# EAGLE design pi3_hat (EAGLE 9.6.0)
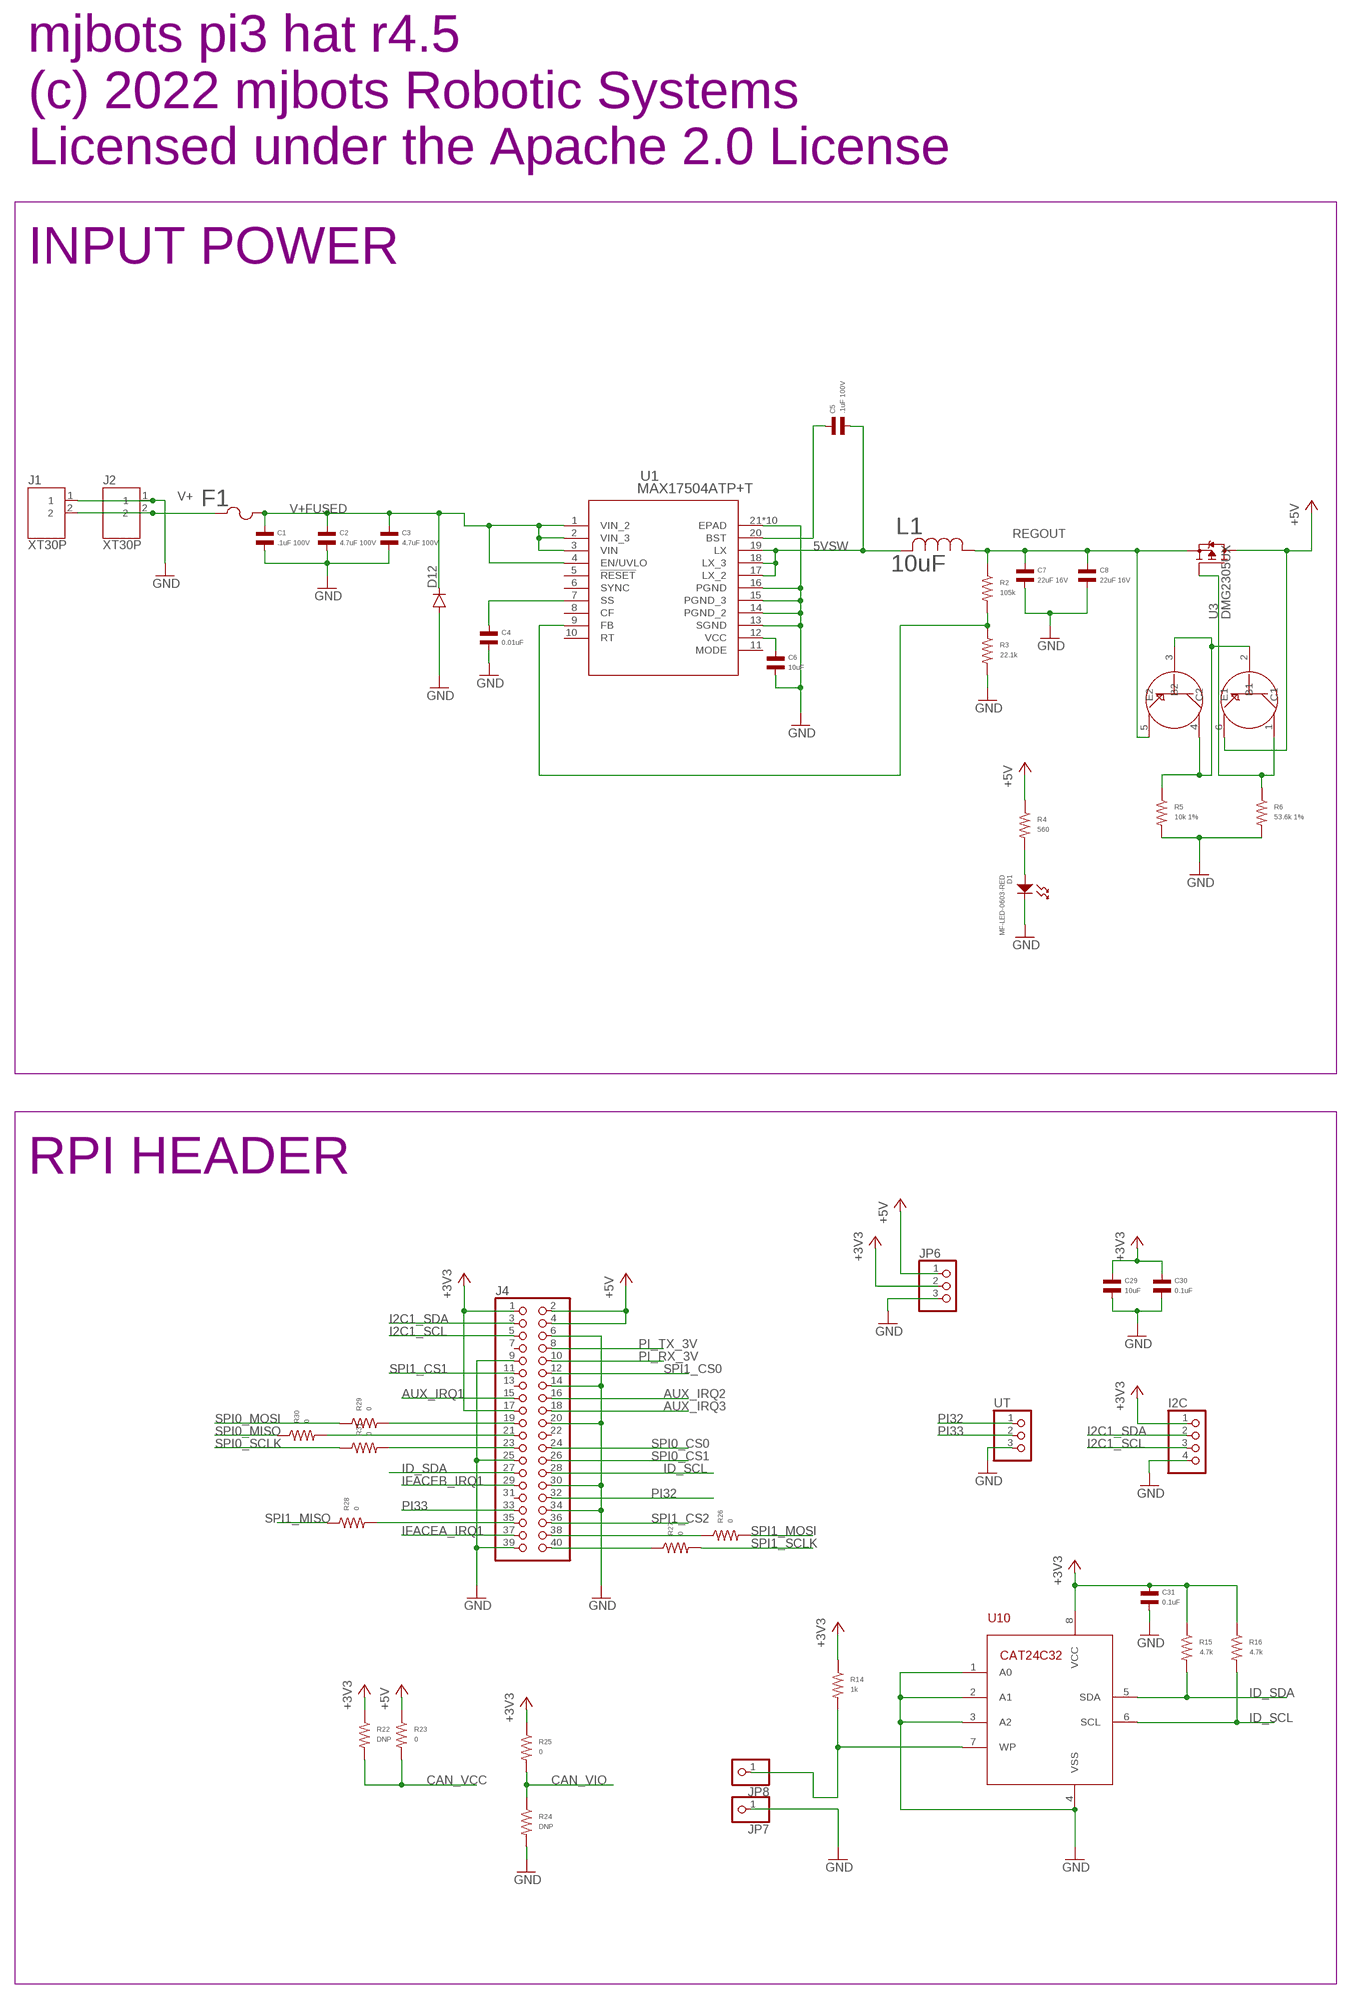
[diagram p0: schematic, sheet 1, part 1 of 3]
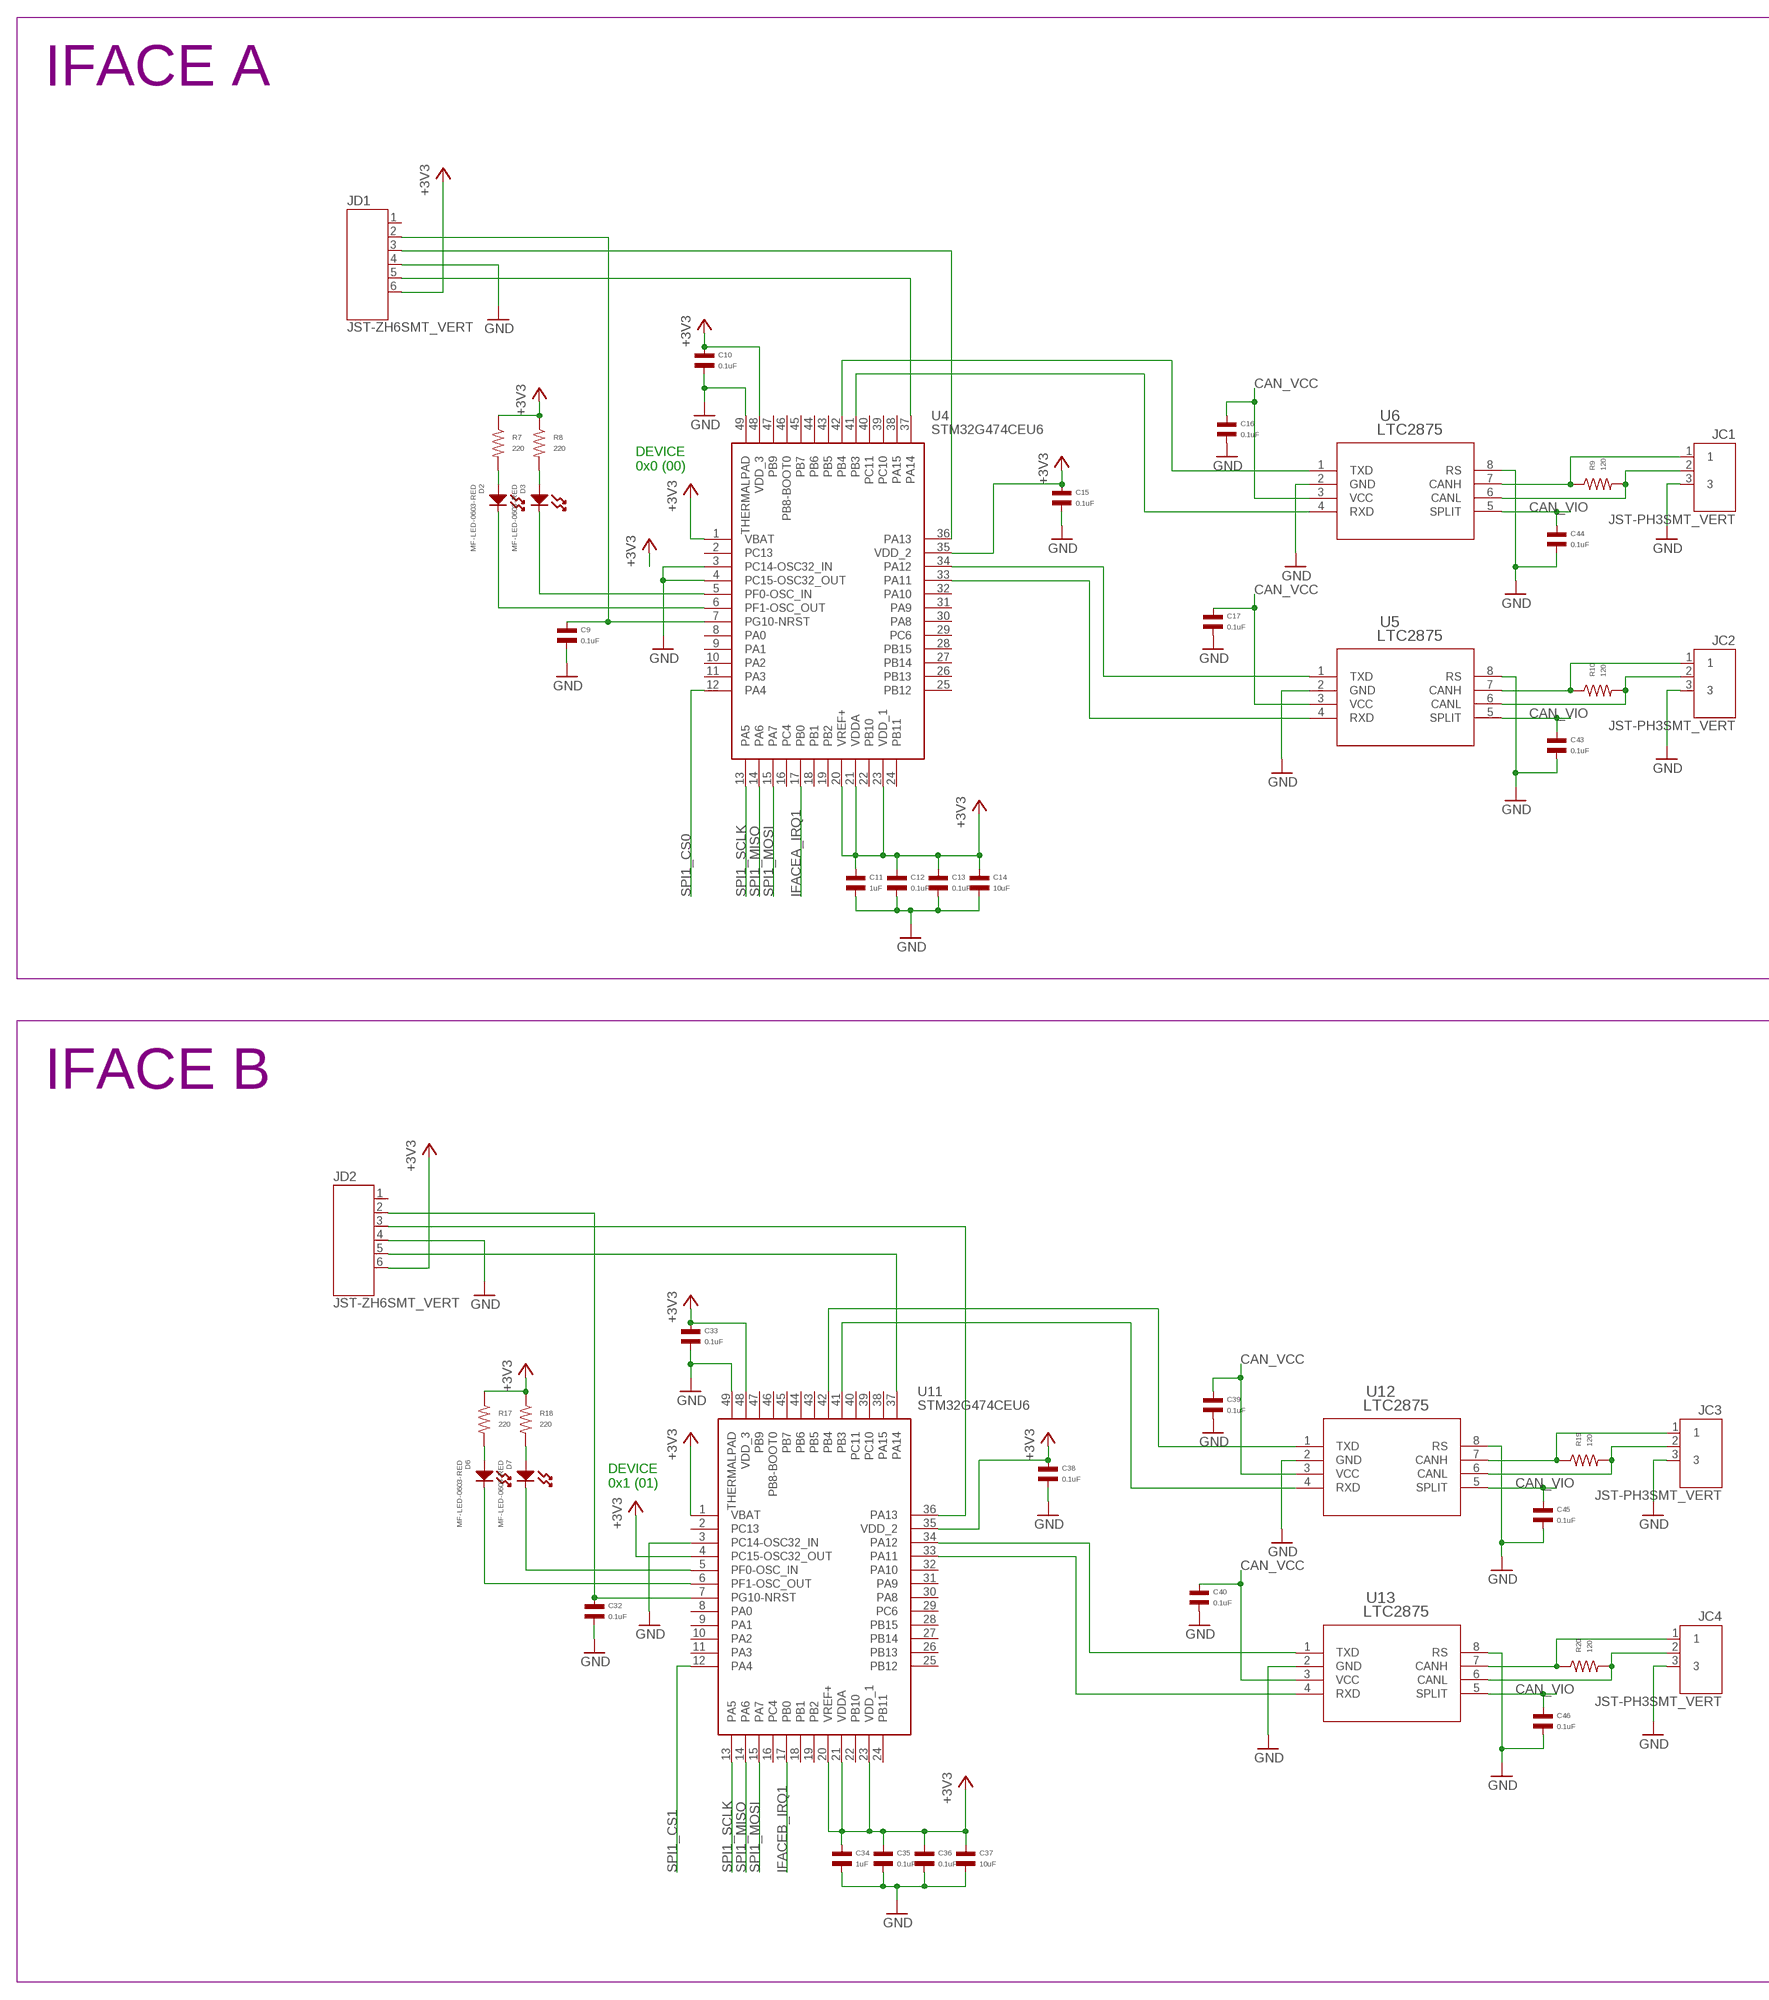
[diagram p1: schematic, sheet 1, part 2 of 3]
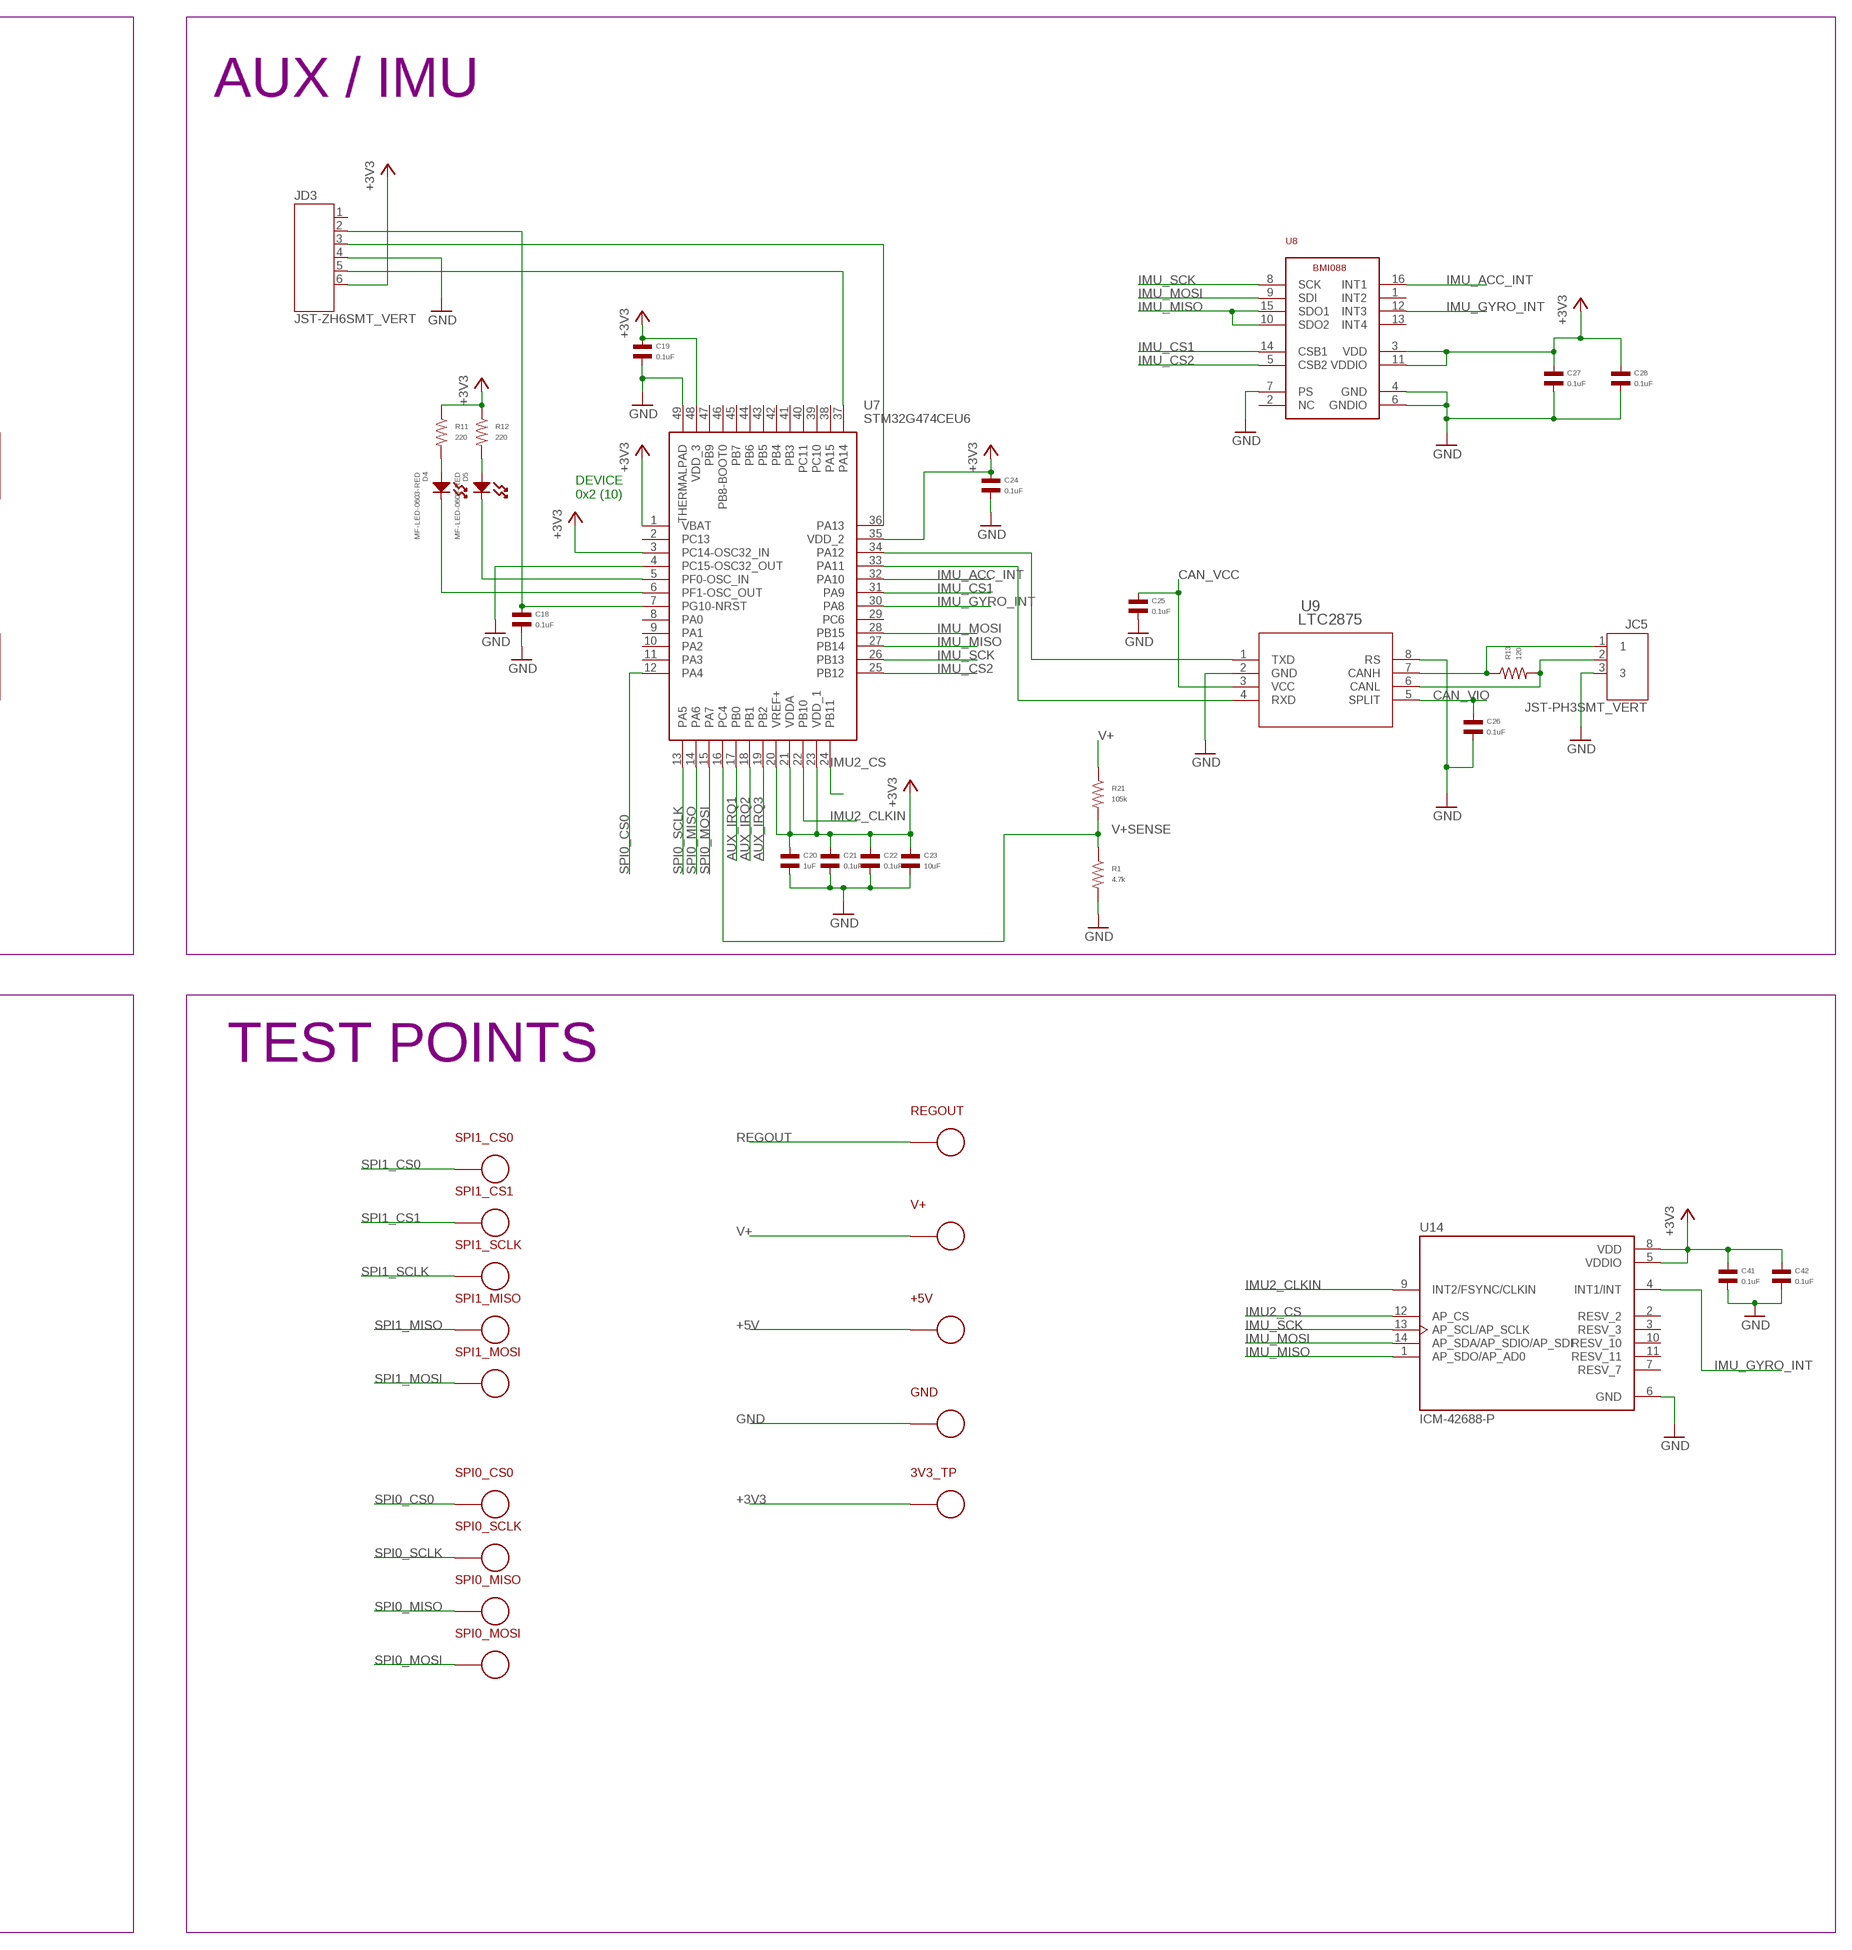
[diagram p2: schematic, sheet 1, part 3 of 3]

## Parts
3V3_TP  PAD24AWG_PAD  [24AWG_PAD]
+5V  PAD24AWG_PAD  [24AWG_PAD]
C1  .1uF 100V  CAPACITOR_NP_0805  [C0805]
C2  4.7uF 100V  CAPACITOR_NP_1206  [C1206]
C3  4.7uF 100V  CAPACITOR_NP_1206  [C1206]
C4  0.01uF  CAPACITOR_NP_0603  [C0603]
C5  .1uF 100V  CAPACITOR_NP_0805  [C0805]
C6  10uF  CAPACITOR_NP_1206  [C1206]
C7  22uF 16V  CAPACITOR_NP_1210  [C1210]
C8  22uF 16V  CAPACITOR_NP_1210  [C1210]
C9  0.1uF  CAPACITOR_NP_0402  [C0402]
C10  0.1uF  CAPACITOR_NP_0402  [C0402]
C11  1uF  CAPACITOR_NP_0402  [C0402]
C12  0.1uF  CAPACITOR_NP_0402  [C0402]
C13  0.1uF  CAPACITOR_NP_0402  [C0402]
C14  10uF  CAPACITOR_NP_1206  [C1206]
C15  0.1uF  CAPACITOR_NP_0402  [C0402]
C16  0.1uF  CAPACITOR_NP_0402  [C0402]
C17  0.1uF  CAPACITOR_NP_0402  [C0402]
C18  0.1uF  CAPACITOR_NP_0402  [C0402]
C19  0.1uF  CAPACITOR_NP_0402  [C0402]
C20  1uF  CAPACITOR_NP_0402  [C0402]
C21  0.1uF  CAPACITOR_NP_0402  [C0402]
C22  0.1uF  CAPACITOR_NP_0402  [C0402]
C23  10uF  CAPACITOR_NP_1206  [C1206]
C24  0.1uF  CAPACITOR_NP_0402  [C0402]
C25  0.1uF  CAPACITOR_NP_0402  [C0402]
C26  0.1uF  CAPACITOR_NP_0402  [C0402]
C27  0.1uF  CAPACITOR_NP_0402  [C0402]
C28  0.1uF  CAPACITOR_NP_0402  [C0402]
C29  10uF  CAPACITOR_NP_1206  [C1206]
C30  0.1uF  CAPACITOR_NP_0402  [C0402]
C31  0.1uF  CAPACITOR_NP_0402  [C0402]
C32  0.1uF  CAPACITOR_NP_0402  [C0402]
C33  0.1uF  CAPACITOR_NP_0402  [C0402]
C34  1uF  CAPACITOR_NP_0402  [C0402]
C35  0.1uF  CAPACITOR_NP_0402  [C0402]
C36  0.1uF  CAPACITOR_NP_0402  [C0402]
C37  10uF  CAPACITOR_NP_1206  [C1206]
C38  0.1uF  CAPACITOR_NP_0402  [C0402]
C39  0.1uF  CAPACITOR_NP_0402  [C0402]
C40  0.1uF  CAPACITOR_NP_0402  [C0402]
C41  0.1uF  CAPACITOR_NP_0402  [C0402]
C42  0.1uF  CAPACITOR_NP_0402  [C0402]
C43  0.1uF  CAPACITOR_NP_0402  [C0402]
C44  0.1uF  CAPACITOR_NP_0402  [C0402]
C45  0.1uF  CAPACITOR_NP_0402  [C0402]
C46  0.1uF  CAPACITOR_NP_0402  [C0402]
D1  MF-LED-0603-RED  LED_SINGLE-0603-RED  [LED0603]
D2  MF-LED-0603-RED  LED_SINGLE-0603-RED  [LED0603]
D3  MF-LED-0603-RED  LED_SINGLE-0603-RED  [LED0603]
D4  MF-LED-0603-RED  LED_SINGLE-0603-RED  [LED0603]
D5  MF-LED-0603-RED  LED_SINGLE-0603-RED  [LED0603]
D6  MF-LED-0603-RED  LED_SINGLE-0603-RED  [LED0603]
D7  MF-LED-0603-RED  LED_SINGLE-0603-RED  [LED0603]
D12  DIODE-DO214AA  [DO214AA]
F1  MFU0603FF04000P100  [FUS_VISHAY_MFU0603]
GND  PAD24AWG_PAD  [24AWG_PAD]
I2C  PINHD-1X4  [1X04]
J1  XT30P  [XT30P]
J2  XT30P  [XT30P]
J4  PI3_HEADER2X20-FLIP  [2X20FLIP]
JC1  JST-PH3SMT_VERT  [JST_B3B_PH-SM4-TB(LF)(SN)]
JC2  JST-PH3SMT_VERT  [JST_B3B_PH-SM4-TB(LF)(SN)]
JC3  JST-PH3SMT_VERT  [JST_B3B_PH-SM4-TB(LF)(SN)]
JC4  JST-PH3SMT_VERT  [JST_B3B_PH-SM4-TB(LF)(SN)]
JC5  JST-PH3SMT_VERT  [JST_B3B_PH-SM4-TB(LF)(SN)]
JD1  JST-ZH6SMT_VERT  [JST_B6B-ZR-SM4-TF(LF)(SN)]
JD2  JST-ZH6SMT_VERT  [JST_B6B-ZR-SM4-TF(LF)(SN)]
JD3  JST-ZH6SMT_VERT  [JST_B6B-ZR-SM4-TF(LF)(SN)]
JP6  PINHD-1X3  [1X03]
JP7  PINHD-1X1  [1X01]
JP8  PINHD-1X1  [1X01]
L1  10uF  NS10165T100MNA  [IND_YUDEN_NS10165_YDN]
R1  4.7k  RESISTOR_0402  [R0402]
R2  105k  RESISTOR_0402  [R0402]
R3  22.1k  RESISTOR_0402  [R0402]
R4  560  RESISTOR_0402  [R0402]
R5  10k 1%  RESISTOR_0603  [R0603]
R6  53.6k 1%  RESISTOR_0603  [R0603]
R7  220  RESISTOR_0402  [R0402]
R8  220  RESISTOR_0402  [R0402]
R9  120  RESISTOR_0402  [R0402]
R10  120  RESISTOR_0402  [R0402]
R11  220  RESISTOR_0402  [R0402]
R12  220  RESISTOR_0402  [R0402]
R13  120  RESISTOR_0402  [R0402]
R14  1k  RESISTOR_0402  [R0402]
R15  4.7k  RESISTOR_0402  [R0402]
R16  4.7k  RESISTOR_0402  [R0402]
R17  220  RESISTOR_0402  [R0402]
R18  220  RESISTOR_0402  [R0402]
R19  120  RESISTOR_0402  [R0402]
R20  120  RESISTOR_0402  [R0402]
R21  105k  RESISTOR_0402  [R0402]
R22  DNP  RESISTOR_0402  [R0402]
R23  0  RESISTOR_0402  [R0402]
R24  DNP  RESISTOR_0402  [R0402]
R25  0  RESISTOR_0402  [R0402]
R26  0  RESISTOR_0402  [R0402]
R27  0  RESISTOR_0402  [R0402]
R28  0  RESISTOR_0402  [R0402]
R29  0  RESISTOR_0402  [R0402]
R30  0  RESISTOR_0402  [R0402]
R31  0  RESISTOR_0402  [R0402]
REGOUT  PAD24AWG_PAD  [24AWG_PAD]
SPI0_CS0  PAD24AWG_PAD  [24AWG_PAD]
SPI0_MISO  PAD24AWG_PAD  [24AWG_PAD]
SPI0_MOSI  PAD24AWG_PAD  [24AWG_PAD]
SPI0_SCLK  PAD24AWG_PAD  [24AWG_PAD]
SPI1_CS0  PAD24AWG_PAD  [24AWG_PAD]
SPI1_CS1  PAD24AWG_PAD  [24AWG_PAD]
SPI1_MISO  PAD24AWG_PAD  [24AWG_PAD]
SPI1_MOSI  PAD24AWG_PAD  [24AWG_PAD]
SPI1_SCLK  PAD24AWG_PAD  [24AWG_PAD]
U1  MAX17504ATP+T  [21-0140L_T2055-4_MXM]
U2  DMMT5401  [SOT26]
U3  DMG2305UX  [SOT23]
U4  STM32G474CEU6  [QFN50P700X700X60-49N]
U5  LTC2875  [SOIC8]
U6  LTC2875  [SOIC8]
U7  STM32G474CEU6  [QFN50P700X700X60-49N]
U8  BMI088LGA16  [LGA16]
U9  LTC2875  [SOIC8]
U10  CAT24C32UDFN8  [UDFN8_2X3_ONS]
U11  STM32G474CEU6  [QFN50P700X700X60-49N]
U12  LTC2875  [SOIC8]
U13  LTC2875  [SOIC8]
U14  ICM-42688-P  [PQFN50P300X250X97-14N]
UT  PINHD-1X3  [1X03]
V+  PAD24AWG_PAD  [24AWG_PAD]

## Nets
5VSW: C5.P$2 L1.2 U1.17(LX_2) U1.18(LX_3) U1.19(LX)
+3V3: 3V3_TP.P$1 C10.P$1 C11.P$1 C12.P$1 C13.P$1 C14.P$1 C15.P$1 C19.P$1 C20.P$1 C21.P$1 C22.P$1 C23.P$1 C24.P$1 C27.P$1 C28.P$1 C29.P$1 C30.P$1 C31.P$1 C33.P$1 C34.P$1 C35.P$1 C36.P$1 C37.P$1 C38.P$1 C41.P$1 C42.P$1 I2C.1 J4.1 J4.17 JD1.6 JD2.6 JD3.6 JP6.2 R7.P$1 R8.P$1 R11.P$1 R12.P$1 R14.P$1 R15.P$1 R16.P$1 R17.P$1 R18.P$1 R22.P$1 R25.P$1 U4.1(VBAT) U4.20(VREF+) U4.21(VDDA) U4.23(VDD_1) U4.35(VDD_2) U4.48(VDD_3) U7.1(VBAT) U7.3(PC14-OSC32_IN) U7.20(VREF+) U7.21(VDDA) U7.23(VDD_1) U7.35(VDD_2) U7.48(VDD_3) U8.3(VDD) U8.11(VDDIO) U10.8(VCC) U11.1(VBAT) U11.4(PC15-OSC32_OUT) U11.20(VREF+) U11.21(VDDA) U11.23(VDD_1) U11.35(VDD_2) U11.48(VDD_3) U14.5(VDDIO) U14.8(VDD)
+5V: +5V.P$1 J4.2 J4.4 JP6.1 R4.P$1 R23.P$1 U2.6(E1) U3.3(D)
AUX_IRQ1: J4.15 U7.17(PB0)
AUX_IRQ2: J4.16 U7.18(PB1)
AUX_IRQ3: J4.18 U7.19(PB2)
CAN_VCC: C16.P$1 C17.P$1 C25.P$1 C39.P$1 C40.P$1 R22.P$2 R23.P$2 U5.3(VCC) U6.3(VCC) U9.3(VCC) U12.3(VCC) U13.3(VCC)
CAN_VIO: C26.P$1 C43.P$1 C44.P$1 C45.P$1 C46.P$1 R24.P$1 R25.P$2 U5.5(SPLIT) U6.5(SPLIT) U9.5(SPLIT) U12.5(SPLIT) U13.5(SPLIT)
FB: R2.P$2 R3.P$1 U1.9(FB)
GND: C1.P$2 C2.P$2 C3.P$2 C4.P$2 C6.P$2 C7.P$2 C8.P$2 C9.P$2 C10.P$2 C11.P$2 C12.P$2 C13.P$2 C14.P$2 C15.P$2 C16.P$2 C17.P$2 C18.P$2 C19.P$2 C20.P$2 C21.P$2 C22.P$2 C23.P$2 C24.P$2 C25.P$2 C26.P$2 C27.P$2 C28.P$2 C29.P$2 C30.P$2 C31.P$2 C32.P$2 C33.P$2 C34.P$2 C35.P$2 C36.P$2 C37.P$2 C38.P$2 C39.P$2 C40.P$2 C41.P$2 C42.P$2 C43.P$2 C44.P$2 C45.P$2 C46.P$2 D1.CATHODE D12.A GND.P$1 I2C.4 J1.1 J2.1 J4.6 J4.9 J4.14 J4.20 J4.25 J4.30 J4.34 J4.39 JC1.3 JC2.3 JC3.3 JC4.3 JC5.3 JD1.4 JD2.4 JD3.4 JP6.3 JP7.1 R1.P$2 R3.P$2 R5.P$2 R6.P$2 R24.P$2 U1.13(SGND) U1.14(PGND_2) U1.15(PGND_3) U1.16(PGND) U1.21(EPAD) U1.22(EPAD) U1.23(EPAD) U1.24(EPAD) U1.25(EPAD) U1.26(EPAD) U1.27(EPAD) U1.28(EPAD) U1.29(EPAD) U1.30(EPAD) U4.3(PC14-OSC32_IN) U4.4(PC15-OSC32_OUT) U4.49(THERMALPAD) U5.2(GND) U5.8(RS) U6.2(GND) U6.8(RS) U7.4(PC15-OSC32_OUT) U7.49(THERMALPAD) U8.4(GND) U8.6(GNDIO) U8.7(PS) U9.2(GND) U9.8(RS) U10.1(A0) U10.2(A1) U10.3(A2) U10.4(VSS) U11.3(PC14-OSC32_IN) U11.49(THERMALPAD) U12.2(GND) U12.8(RS) U13.2(GND) U13.8(RS) U14.6(GND) UT.3
I2C1_SCL: I2C.3 J4.5
I2C1_SDA: I2C.2 J4.3
ID_SCL: J4.28 R16.P$2 U10.6(SCL)
ID_SDA: J4.27 R15.P$2 U10.5(SDA)
IFACEA_IRQ1: J4.37 U4.17(PB0)
IFACEB_IRQ1: J4.29 U11.17(PB0)
IMU2_CLKIN: U7.22(PB10) U14.9(INT2/FSYNC/CLKIN)
IMU2_CS: U7.24(PB11) U14.12(AP_CS)
IMU_ACC_INT: U7.32(PA10) U8.16(INT1)
IMU_CS1: U7.31(PA9) U8.14(CSB1)
IMU_CS2: U7.25(PB12) U8.5(CSB2)
IMU_GYRO_INT: U7.30(PA8) U8.12(INT3) U14.4(INT1/INT)
IMU_MISO: U7.27(PB14) U8.10(SDO2) U8.15(SDO1) U14.1(AP_SDO/AP_AD0)
IMU_MOSI: U7.28(PB15) U8.9(SDI) U14.14(AP_SDA/AP_SDIO/AP_SDI)
IMU_SCK: U7.26(PB13) U8.8(SCK) U14.13(AP_SCL/AP_SCLK)
N$1: R5.P$1 U2.2(B1) U2.3(B2) U2.4(C2)
N$2: JC1.1 R9.P$1 U6.7(CANH)
N$3: J4.38 R26.P$1
N$4: JC1.2 R9.P$2 U6.6(CANL)
N$5: R6.P$1 U2.1(C1) U3.1(G)
N$6: J4.40 R27.P$1
N$7: JC2.1 R10.P$1 U5.7(CANH)
N$8: JC2.2 R10.P$2 U5.6(CANL)
N$9: D1.ANODE R4.P$2
N$10: J4.35 R28.P$2
N$11: U4.33(PA11) U5.4(RXD)
N$12: J4.19 R29.P$2
N$13: C9.P$1 JD1.2 U4.7(PG10-NRST)
N$14: C5.P$1 U1.20(BST)
N$15: JD1.3 U4.36(PA13)
N$16: JD1.5 U4.37(PA14)
N$17: U4.41(PB3) U6.4(RXD)
N$18: U4.42(PB4) U6.1(TXD)
N$19: C4.P$1 U1.7(SS)
N$20: J4.21 R30.P$2
N$21: C6.P$1 U1.12(VCC)
N$22: J4.23 R31.P$2
N$23: JC3.1 R19.P$1 U12.7(CANH)
N$25: JC3.2 R19.P$2 U12.6(CANL)
N$26: JC4.1 R20.P$1 U13.7(CANH)
N$27: JC4.2 R20.P$2 U13.6(CANL)
N$28: D3.ANODE R8.P$2
N$29: D3.CATHODE U4.5(PF0-OSC_IN)
N$30: D2.ANODE R7.P$2
N$31: D2.CATHODE U4.6(PF1-OSC_OUT)
N$32: C32.P$1 JD2.2 U11.7(PG10-NRST)
N$33: JD2.3 U11.36(PA13)
N$34: JD2.5 U11.37(PA14)
N$35: D7.ANODE R18.P$2
N$36: D7.CATHODE U11.5(PF0-OSC_IN)
N$37: D6.ANODE R17.P$2
N$38: D6.CATHODE U11.6(PF1-OSC_OUT)
N$39: U11.33(PA11) U13.4(RXD)
N$40: U11.34(PA12) U13.1(TXD)
N$41: U11.41(PB3) U12.4(RXD)
N$42: U11.42(PB4) U12.1(TXD)
N$44: JP8.1 R14.P$2 U10.7(WP)
N$45: JC5.1 R13.P$1 U9.7(CANH)
N$46: JC5.2 R13.P$2 U9.6(CANL)
N$47: C18.P$1 JD3.2 U7.7(PG10-NRST)
N$48: JD3.3 U7.36(PA13)
N$49: JD3.5 U7.37(PA14)
N$50: D5.ANODE R12.P$2
N$51: D5.CATHODE U7.5(PF0-OSC_IN)
N$52: D4.ANODE R11.P$2
N$53: D4.CATHODE U7.6(PF1-OSC_OUT)
N$54: U7.33(PA11) U9.4(RXD)
N$55: U7.34(PA12) U9.1(TXD)
N$100: U4.34(PA12) U5.1(TXD)
PI32: J4.32 UT.1
PI33: J4.33 UT.2
PI_RX_3V: J4.10
PI_TX_3V: J4.8
REGOUT: C7.P$1 C8.P$1 L1.1 R2.P$1 REGOUT.P$1 U2.5(E2) U3.2(S)
SPI0_CS0: J4.24 SPI0_CS0.P$1 U7.12(PA4)
SPI0_CS1: J4.26
SPI0_MISO: R30.P$1 SPI0_MISO.P$1 U7.14(PA6)
SPI0_MOSI: R29.P$1 SPI0_MOSI.P$1 U7.15(PA7)
SPI0_SCLK: R31.P$1 SPI0_SCLK.P$1 U7.13(PA5)
SPI1_CS0: J4.12 SPI1_CS0.P$1 U4.12(PA4)
SPI1_CS1: J4.11 SPI1_CS1.P$1 U11.12(PA4)
SPI1_CS2: J4.36
SPI1_MISO: R28.P$1 SPI1_MISO.P$1 U4.14(PA6) U11.14(PA6)
SPI1_MOSI: R26.P$2 SPI1_MOSI.P$1 U4.15(PA7) U11.15(PA7)
SPI1_SCLK: R27.P$2 SPI1_SCLK.P$1 U4.13(PA5) U11.13(PA5)
V+: F1.1 J1.2 J2.2 R21.P$1 V+.P$1
V+FUSED: C1.P$1 C2.P$1 C3.P$1 D12.C F1.2 U1.1(VIN_2) U1.2(VIN_3) U1.3(VIN) U1.4(EN/UVLO)
V+SENSE: R1.P$1 R21.P$2 U7.16(PC4)
Unconnected: J4.7 J4.13 J4.22 J4.31 JD1.1 JD2.1 JD3.1 U1.5(!RESET) U1.6(SYNC) U1.8(CF) U1.10(RT) U1.11(MODE) U4.2(PC13) U4.8(PA0) U4.9(PA1) U4.10(PA2) U4.11(PA3) U4.16(PC4) U4.18(PB1) U4.19(PB2) U4.22(PB10) U4.24(PB11) U4.25(PB12) U4.26(PB13) U4.27(PB14) U4.28(PB15) U4.29(PC6) U4.30(PA8) U4.31(PA9) U4.32(PA10) U4.38(PA15) U4.39(PC10) U4.40(PC11) U4.43(PB5) U4.44(PB6) U4.45(PB7) U4.46(PB8-BOOT0) U4.47(PB9) U7.2(PC13) U7.8(PA0) U7.9(PA1) U7.10(PA2) U7.11(PA3) U7.29(PC6) U7.38(PA15) U7.39(PC10) U7.40(PC11) U7.41(PB3) U7.42(PB4) U7.43(PB5) U7.44(PB6) U7.45(PB7) U7.46(PB8-BOOT0) U7.47(PB9) U8.1(INT2) U8.2(NC) U8.13(INT4) U11.2(PC13) U11.8(PA0) U11.9(PA1) U11.10(PA2) U11.11(PA3) U11.16(PC4) U11.18(PB1) U11.19(PB2) U11.22(PB10) U11.24(PB11) U11.25(PB12) U11.26(PB13) U11.27(PB14) U11.28(PB15) U11.29(PC6) U11.30(PA8) U11.31(PA9) U11.32(PA10) U11.38(PA15) U11.39(PC10) U11.40(PC11) U11.43(PB5) U11.44(PB6) U11.45(PB7) U11.46(PB8-BOOT0) U11.47(PB9) U14.2(RESV_2) U14.3(RESV_3) U14.7(RESV_7) U14.10(RESV_10) U14.11(RESV_11)

## Notes on the sheet
- mjbots pi3 hat r4.5
  (c) 2022 mjbots Robotic Systems
  Licensed under the Apache 2.0 License
- INPUT POWER | IFACE A | AUX / IMU
- DEVICE
  0x0 (00)
- DEVICE
  0x2 (10)
- RPI HEADER | IFACE B | TEST POINTS
- DEVICE
  0x1 (01)

## Library data of the parts
3V3_TP +5V GND REGOUT SPI0_CS0 SPI0_MISO SPI0_MOSI SPI0_SCLK SPI1_CS0 SPI1_CS1 SPI1_MISO SPI1_MOSI SPI1_SCLK V+ = pi3_hat:PAD; POPULATE: 0
C1 C5 = mfpassives:CAPACITOR_NP: Library: MF_Passives Description: Device for Non-Polarized Capacitors. Manufacture part number (MPN) can be added via Attributes. Check https://factory.macrofab.com/parts for the house parts list.; HOUSEPART: 0; MF: KYOCERA; MPN: 08051C104KAZ2A; POPULATE: 1
C2 C3 = mfpassives:CAPACITOR_NP: Library: MF_Passives Description: Device for Non-Polarized Capacitors. Manufacture part number (MPN) can be added via Attributes. Check https://factory.macrofab.com/parts for the house parts list.; MF: MURATA; MPN: GRJ31CC72A475KE01K; POPULATE: 1
C4 = mfpassives:CAPACITOR_NP: Library: MF_Passives Description: Device for Non-Polarized Capacitors. Manufacture part number (MPN) can be added via Attributes. Check https://factory.macrofab.com/parts for the house parts list.; MPN: MF-CAP-0603-0.01uF; POPULATE: 1
C6 C14 C23 C29 C37 = mfpassives:CAPACITOR_NP: Library: MF_Passives Description: Device for Non-Polarized Capacitors. Manufacture part number (MPN) can be added via Attributes. Check https://factory.macrofab.com/parts for the house parts list.; HOUSEPART: YES; MPN: MF-CAP-1206-10uF; POPULATE: 1
C7 C8 = mfpassives:CAPACITOR_NP: Library: MF_Passives Description: Device for Non-Polarized Capacitors. Manufacture part number (MPN) can be added via Attributes. Check https://factory.macrofab.com/parts for the house parts list.; MF: SAMSUNG; MPN: CL32A226KOJNNNE; POPULATE: 1
C9 C10 C12 C13 C15-C19 C21 C22 C24-C28 C30-C33 C35 C36 C38-C46 = mfpassives:CAPACITOR_NP: Library: MF_Passives Description: Device for Non-Polarized Capacitors. Manufacture part number (MPN) can be added via Attributes. Check https://factory.macrofab.com/parts for the house parts list.; HOUSEPART: YES; MPN: MF-CAP-0402-0.1uF; POPULATE: 1
C11 C20 C34 = mfpassives:CAPACITOR_NP: Library: MF_Passives Description: Device for Non-Polarized Capacitors. Manufacture part number (MPN) can be added via Attributes. Check https://factory.macrofab.com/parts for the house parts list.; HOUSEPART: YES; MPN: MF-CAP-0402-1uF; POPULATE: 1
D1 D2 D4 D6 = mfleds:LED_SINGLE: Library: MF_LEDs Description: Device for Single LED Packages. Manufacture part number (MFG#) can be added via Attributes.; HOUSEPART: YES; MPN: MF-LED-0603-RED; POPULATE: 1; URL: https://factory.macrofab.com/part/MF-LED-0603-RED
D3 D5 D7 = mfleds:LED_SINGLE: Library: MF_LEDs Description: Device for Single LED Packages. Manufacture part number (MFG#) can be added via Attributes.; HOUSEPART: YES; MPN: MF-LED-0603-GREEN; POPULATE: 1; URL: https://factory.macrofab.com/part/MF-LED-0603-RED
D12 = diode:DIODE-: DIODE; MF: LITTLEFUSE; MPN: SMBJ51A-13-F; POPULATE: 1
F1 = pi3_hat:MFU0603FF04000P100; DPN: 507-2154-1-ND; MF: BEL FUSE; MPN: 0686F4000-01; POPULATE: 1; VENDOR: BEL FUSE
I2C = pinhead:PINHD-1X4: PIN HEADER; MF: MacroFab; MPN: MF-CON-2.54mm-01x04; POPULATE: 1
J1 J2 = pi3_hat:XT30; MF: AMASS; MPN: XT30UPB-M; POPULATE: 1
J4 = pi3_hat:PI3_HEADER: PIN HEADER; MF: SULLINS; MPN: PPPC202LFBN-RC; POPULATE: 1
JC1-JC5 = pi3_hat:JST-PH3; MF: JST; MPN: B3B-PH-SM4-TB(LF)(SN); POPULATE: 1
JD1-JD3 = pi3_hat:JST-ZH6; MF: JST; MPN: B6B-ZR-SM4-TF(LF)(SN); POPULATE: 1
JP6 UT = pinhead:PINHD-1X3: PIN HEADER; MF: MacroFab; MPN: MF-CON-2.54mm-01x03; POPULATE: 1
JP7 JP8 = adafruit:PINHD-1X1: Pin header 1x1 for 0.1" spacing With round pins; POPULATE: 0
L1 = pi3_hat:NS10165T100MNA; BUILT_BY: EMA_UL_Team; MANUFACTURER_PART_NUMBER: NS10165T100MNA; MPN: NS10165T100MNA; POPULATE: 1; SOURCELIBRARY: Yuden_2012-01-01_IND_NS; VENDOR: Taiyo Yuden
R1 R15 R16 = mfpassives:RESISTOR: Library: MF_Passives Description: Device for Resistors. Manufacture part number (MPN), Voltage, Tolerance, and Wattage Rating can be added via Attributes. Check https://factory.macrofab.com/parts for the house parts list.; HOUSEPART: YES; MPN: MF-RES-0402-4.7K; POPULATE: 1
R2 R21 = mfpassives:RESISTOR: Library: MF_Passives Description: Device for Resistors. Manufacture part number (MPN), Voltage, Tolerance, and Wattage Rating can be added via Attributes. Check https://factory.macrofab.com/parts for the house parts list.; MF: YAGEO; MPN: RC0402FR-07105KL; POPULATE: 1
R3 = mfpassives:RESISTOR: Library: MF_Passives Description: Device for Resistors. Manufacture part number (MPN), Voltage, Tolerance, and Wattage Rating can be added via Attributes. Check https://factory.macrofab.com/parts for the house parts list.; MF: YAGEO; MPN: RC0402FR-0722K1L; POPULATE: 1
R4 = mfpassives:RESISTOR: Library: MF_Passives Description: Device for Resistors. Manufacture part number (MPN), Voltage, Tolerance, and Wattage Rating can be added via Attributes. Check https://factory.macrofab.com/parts for the house parts list.; HOUSEPART: YES; MPN: MF-RES-0402-560; POPULATE: 1
R5 = mfpassives:RESISTOR: Library: MF_Passives Description: Device for Resistors. Manufacture part number (MPN), Voltage, Tolerance, and Wattage Rating can be added via Attributes. Check https://factory.macrofab.com/parts for the house parts list.; MF: YAGEO; MPN: RC0603FR-0710KL; POPULATE: 1
R6 = mfpassives:RESISTOR: Library: MF_Passives Description: Device for Resistors. Manufacture part number (MPN), Voltage, Tolerance, and Wattage Rating can be added via Attributes. Check https://factory.macrofab.com/parts for the house parts list.; MF: YAGEO; MPN: RC0603FR-0753K6L; POPULATE: 1
R7 R8 R11 R12 R17 R18 = mfpassives:RESISTOR: Library: MF_Passives Description: Device for Resistors. Manufacture part number (MPN), Voltage, Tolerance, and Wattage Rating can be added via Attributes. Check https://factory.macrofab.com/parts for the house parts list.; HOUSEPART: YES; MPN: MF-RES-0402-220; POPULATE: 1
R9 R10 R13 R19 R20 = mfpassives:RESISTOR: Library: MF_Passives Description: Device for Resistors. Manufacture part number (MPN), Voltage, Tolerance, and Wattage Rating can be added via Attributes. Check https://factory.macrofab.com/parts for the house parts list.; HOUSEPART: 0; MPN: RC0402FR-07120RL; POPULATE: 1
R14 = mfpassives:RESISTOR: Library: MF_Passives Description: Device for Resistors. Manufacture part number (MPN), Voltage, Tolerance, and Wattage Rating can be added via Attributes. Check https://factory.macrofab.com/parts for the house parts list.; HOUSEPART: YES; MPN: MF-RES-0402-1K; POPULATE: 1
R22 R24 = mfpassives:RESISTOR: Library: MF_Passives Description: Device for Resistors. Manufacture part number (MPN), Voltage, Tolerance, and Wattage Rating can be added via Attributes. Check https://factory.macrofab.com/parts for the house parts list.; HOUSEPART: YES; MPN: MF-RES-0402-0; POPULATE: 0
R23 R25-R31 = mfpassives:RESISTOR: Library: MF_Passives Description: Device for Resistors. Manufacture part number (MPN), Voltage, Tolerance, and Wattage Rating can be added via Attributes. Check https://factory.macrofab.com/parts for the house parts list.; HOUSEPART: YES; MPN: MF-RES-0402-0; POPULATE: 1
U1 = pi3_hat:MAX17504ATP+T; BUILT_BY: EMA_UL_Team; COPYRIGHT: Copyright (C) 2018 Accelerated Designs. All rights reserved; MANUFACTURER_PART_NUMBER: MAX17504ATP+T; MPN: MAX17504ATP+T; POPULATE: 1; REVISION: 1; SOURCELIBRARY: Maxim_2018-11-30; VENDOR: Maxim Integrated Products
U2 = pi3_hat:DMMT5401; DPN: DMMT5401-FDICT-ND; MF: Didoes Incorporated; MPN: DMMT5401-7-F; POPULATE: 1
U3 = pi3_hat:DMG2305UX; MF: Alpha & Omega; MPN: AO3415A; POPULATE: 1
U4 U7 U11 = pi3_hat:STM32G474CEU6: STMICROELECTRONICS - STM32G474CEU6 - MCU, 32BIT, 170MHZ, UFQFPN-48 Source: Datasheet <https://componentsearchengine.com/Datasheets/1/STM32G474CEU6.pdf>; DESCRIPTION: STMICROELECTRONICS - STM32G474CEU6 - MCU, 32BIT, 170MHZ, UFQFPN-48; HEIGHT: 0.6mm; MANUFACTURER_NAME: STMicroelectronics; MANUFACTURER_PART_NUMBER: STM32G474CEU6; MF: ST; MOUSER_PART_NUMBER: 511-STM32G474CEU6; MOUSER_PRICE-STOCK: https://www.mouser.com/Search/Refine.aspx?Keyword=511-STM32G474CEU6; MPN: STM32G474CEU6; POPULATE: 1
U5 U6 U9 U12 U13 = pi3_hat:LTC2875; MF: Analog; MPN: TCAN1057AEVDRQ1‎; POPULATE: 1
U8 = pi3_hat:BMI088; MF: BOSCH; MPN: BMI088; POPULATE: 0
U10 = pi3_hat:CAT24C32; MF: ON Semiconductor; MPN: CAT24C32HU4I-GT3; POPULATE: 1
U14 = ICM-42688-P:ICM-42688-P: Accelerometer, Gyroscope, 6 Axis Sensor Output; DESCRIPTION: Accelerometer, Gyroscope, 6 Axis Sensor Output; DIGI-KEY_PART_NUMBER: 1428-ICM-42688-PCT-ND; MF: TDK InvenSense; MP: ICM-42688-P; MPN: ICM-42688-P; PACKAGE: Package TDK - InvenSense; POPULATE: 1

## Board
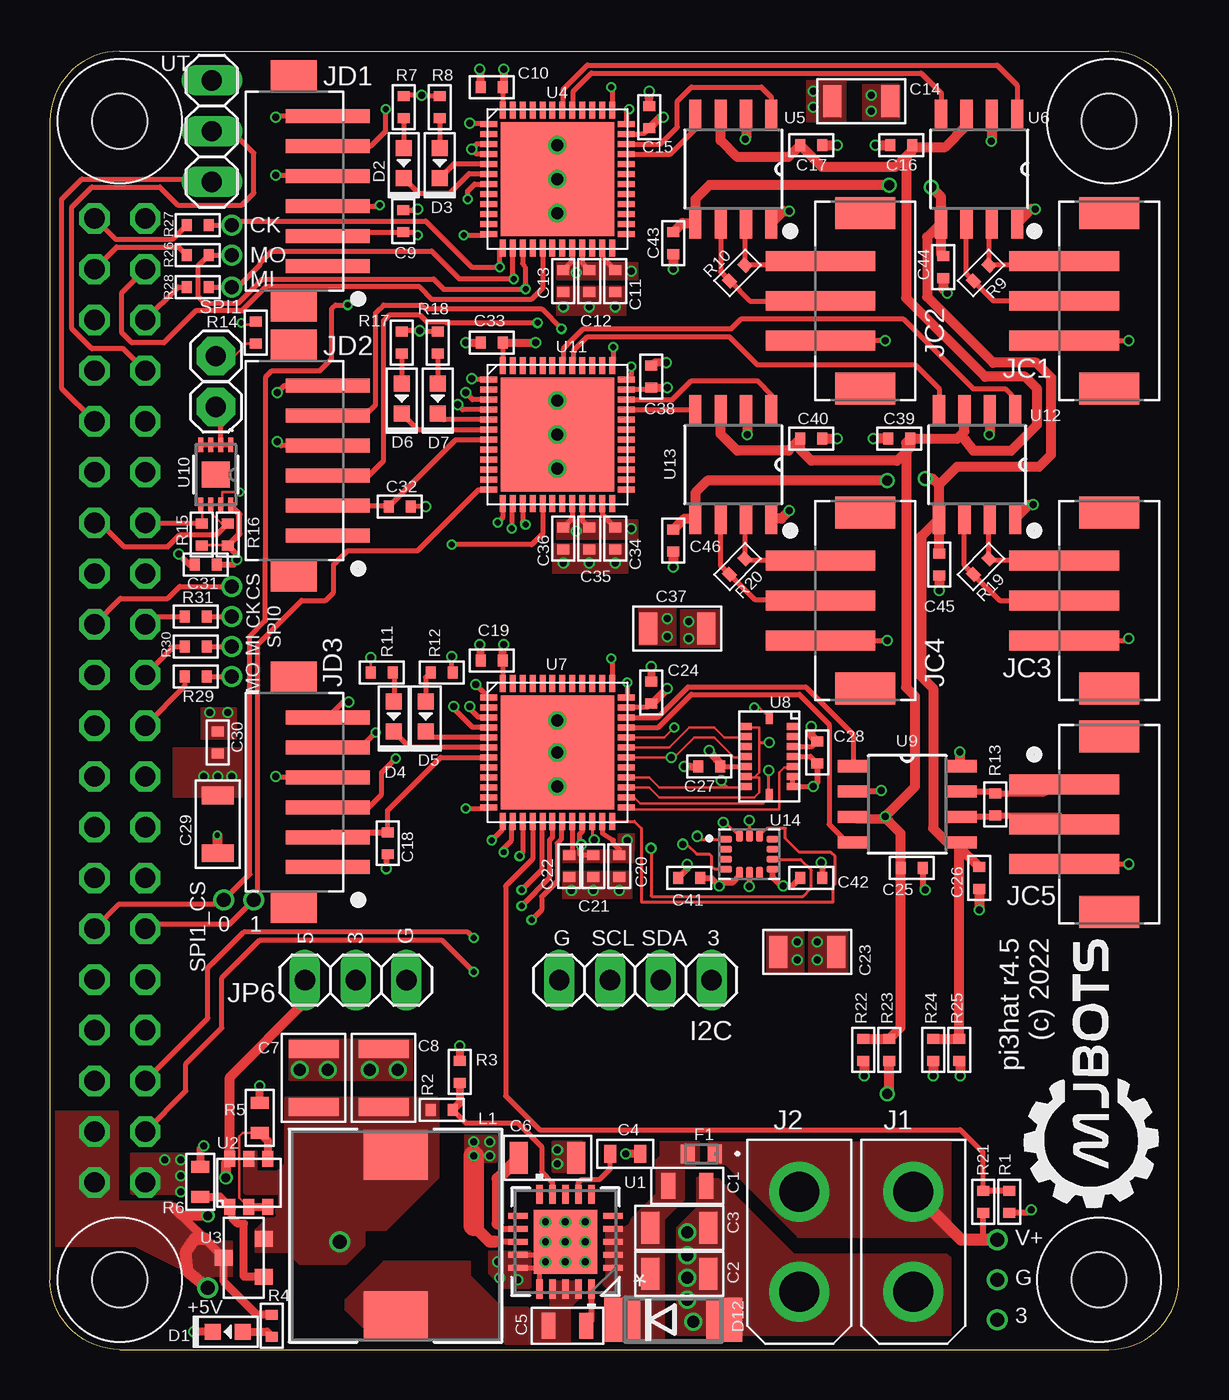
[diagram p3: board, top side]
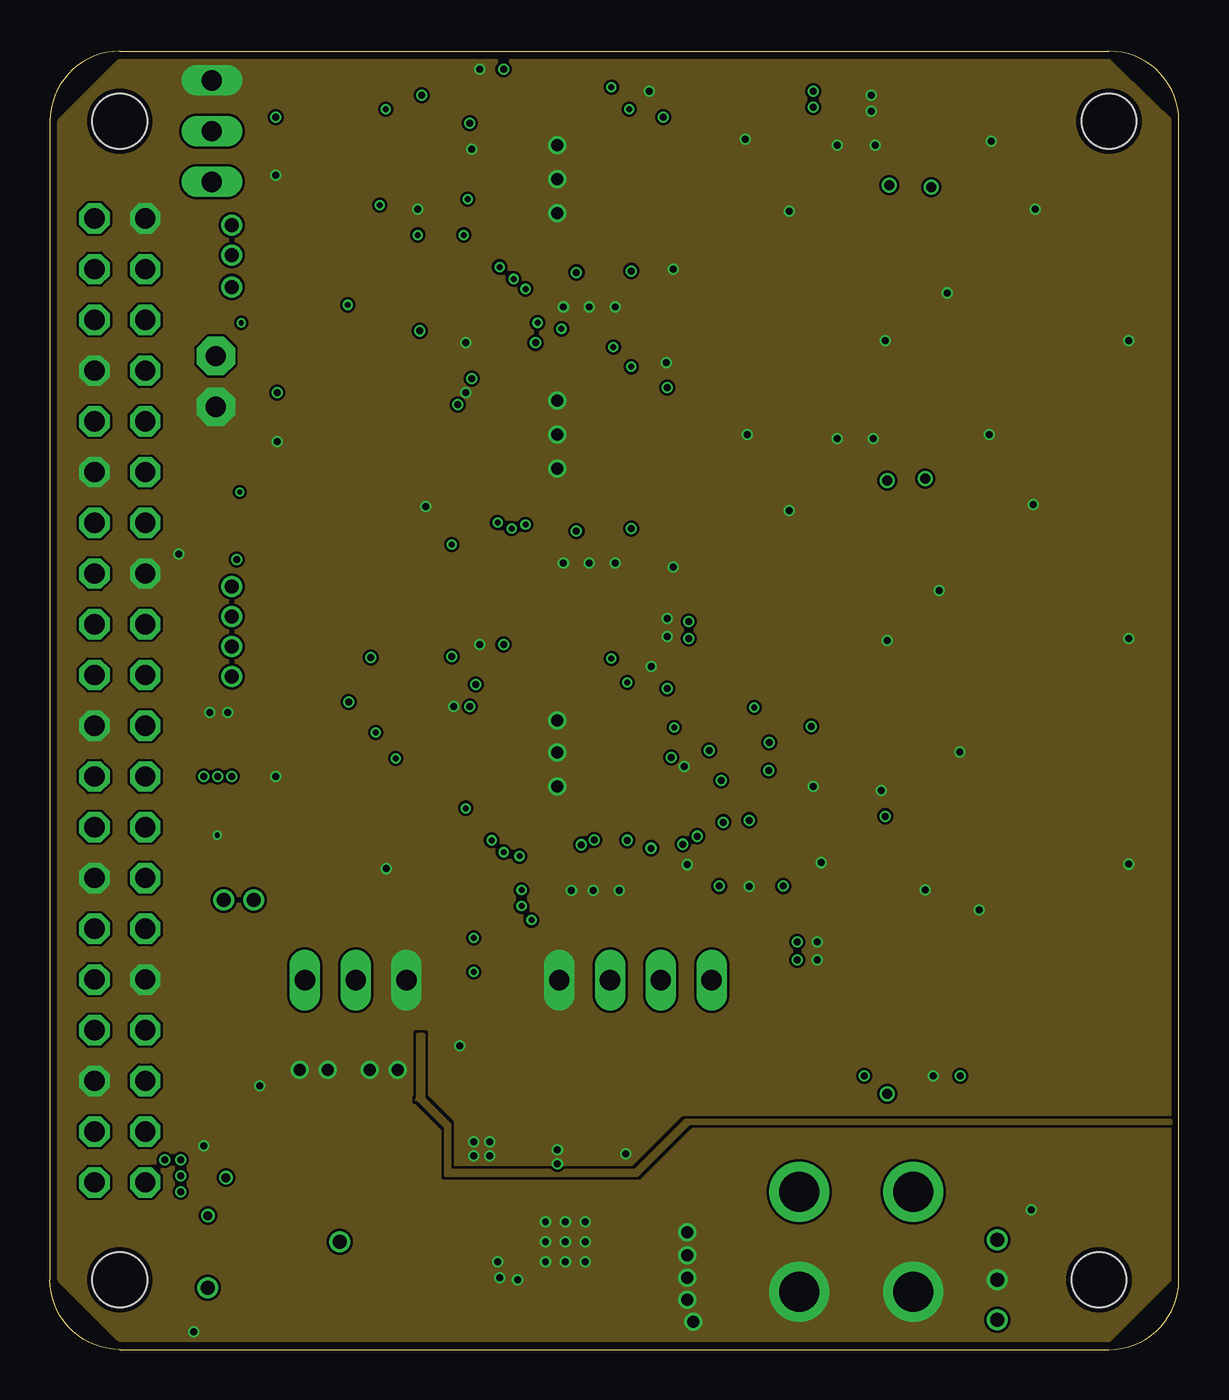
[diagram p4: board, inner layer Route2]
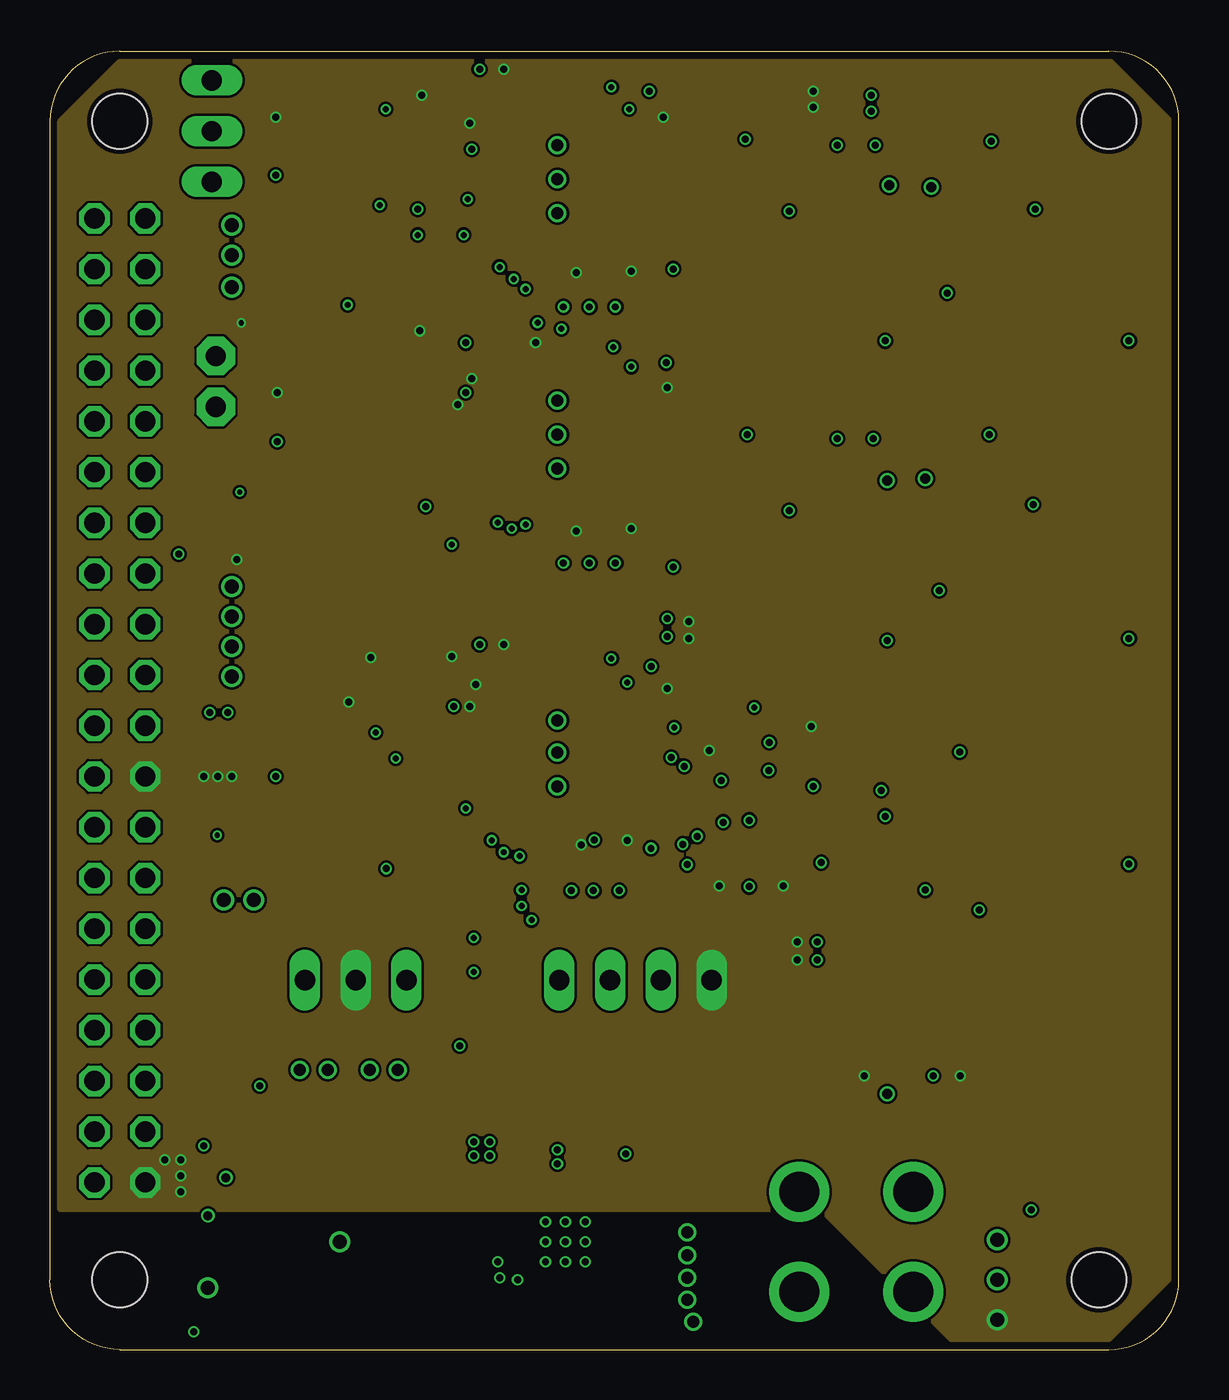
[diagram p5: board, inner layer Route15]
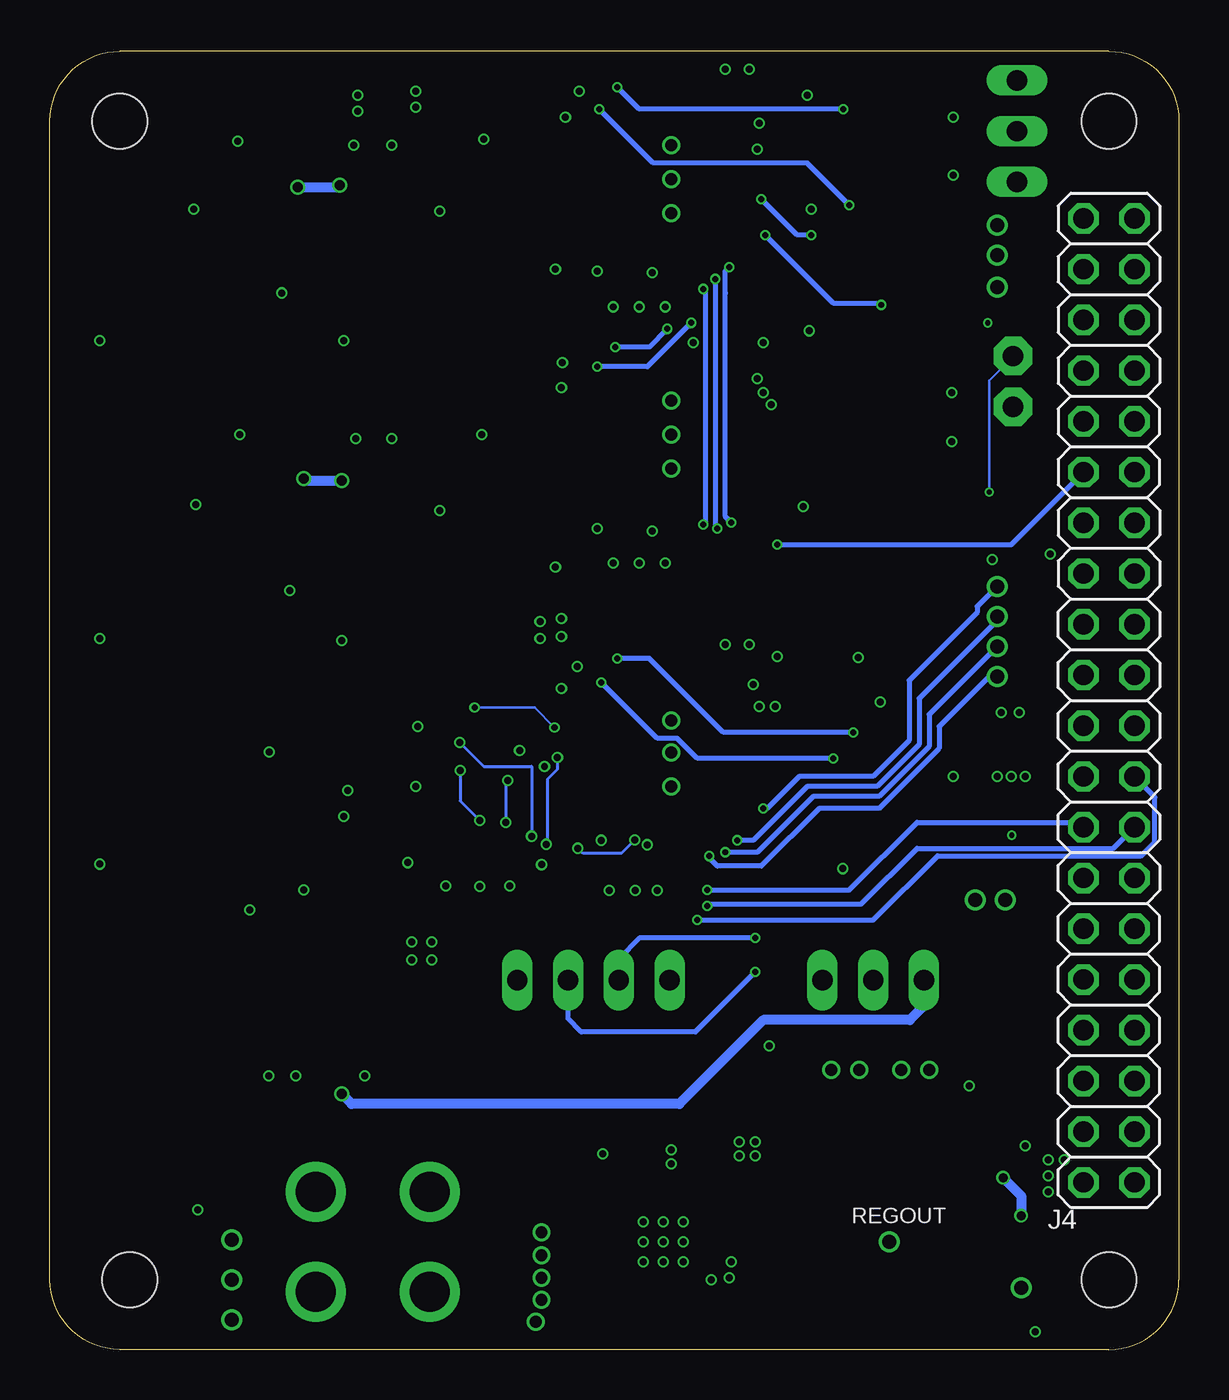
[diagram p6: board, bottom side, seen from below]

Size 56.5 x 65 mm. Coordinates in mm from the lower left corner, seen from the top.
Outline: 3.5,0 53,0 arc90 56.5,3.5 56.5,61.5 arc90 53,65 3.5,65 arc90 0,61.5 0,3.5 arc90 3.5,0
Copper layers (1*2*15*16): Top 0.035mm / dielectric 0.23mm / Route2 0.035mm / dielectric 0.93mm / Route15 0.035mm / dielectric 0.23mm / Bottom 0.035mm
Design rules "MF_4_mil_drill_4_Layer": minimum track width 5mil, minimum drill 4mil, track to track 5mil, track to pad 5mil, pad to pad 5mil, via to via 5mil, smd to smd 0mil, copper to edge 10mil, drill to drill 10mil, minimum pad ring 4mil, minimum via ring 4mil, stop-mask expansion 2mil, vias tented up to drill 25mil, thermal gap 10mil
Holes 2.75 mm at 3.5,3.5 3.5,61.5 53,61.5 52.5,3.5

### Footprints (pad centres in the part's own frame; a part is rotated, then mirrored left to right if it is on the bottom)
24AWG_PAD = drill 0.7: P$1 0,0
C0805 = smd 0.7 x 1.3: P$1 -0.95,0; P$2 0.95,0
C1206 = smd 0.9 x 1.6: P$1 -1.45,0; P$2 1.45,0
C0603 = smd 0.6 x 0.9: P$1 -0.75,0; P$2 0.75,0
C1210 = smd 0.9 x 2.5: P$1 -1.45,0; P$2 1.45,0
C0402 = smd 0.5 x 0.6: P$1 -0.55,0; P$2 0.55,0
LED0603 = smd 0.8 x 0.8: ANODE 0.75,0; CATHODE -0.75,0
DO214AA = smd 1.8 x 2.2: A 2.55,0; C -2.55,0
FUS_VISHAY_MFU0603 = smd 0.699 x 0.94: 1 -0.679,0; 2 0.679,0
1X04 = drill 1.016 long: 1 -3.81,0; 2 -1.27,0; 3 1.27,0; 4 3.81,0
XT30P = drill 2: 1 -2.5,0; 2 2.5,0
2X20FLIP = drill 1.016 octagon: 1 -24.13,1.27; 2 -24.13,-1.27; 3 -21.59,1.27; 4 -21.59,-1.27; 5 -19.05,1.27; 6 -19.05,-1.27; 7 -16.51,1.27; 8 -16.51,-1.27; 9 -13.97,1.27; 10 -13.97,-1.27; 11 -11.43,1.27; 12 -11.43,-1.27; 13 -8.89,1.27; 14 -8.89,-1.27; 15 -6.35,1.27; 16 -6.35,-1.27; 17 -3.81,1.27; 18 -3.81,-1.27; 19 -1.27,1.27; 20 -1.27,-1.27; 21 1.27,1.27; 22 1.27,-1.27; 23 3.81,1.27; 24 3.81,-1.27; 25 6.35,1.27; 26 6.35,-1.27; 27 8.89,1.27; 28 8.89,-1.27; 29 11.43,1.27; 30 11.43,-1.27; 31 13.97,1.27; 32 13.97,-1.27; 33 16.51,1.27; 34 16.51,-1.27; 35 19.05,1.27; 36 19.05,-1.27; 37 21.59,1.27; 38 21.59,-1.27; 39 24.13,1.27; 40 24.13,-1.27
JST_B3B_PH-SM4-TB(LF)(SN) = smd 1 x 5.5: 1 -2,-2.54; 2 0,-2.54; 3 2,-2.54 | smd 1.6 x 3: P1 -4.4,-0.29; P2 4.4,-0.29
JST_B6B-ZR-SM4-TF(LF)(SN) = smd 0.7 x 4.2: 1 -3.75,-2; 2 -2.25,-2; 3 -0.75,-2; 4 0.75,-2; 5 2.25,-2; 6 3.75,-2 | smd 1.5 x 2.3: P1 -5.8,-0.29; P2 5.8,-0.29
1X03 = drill 1.016 long: 1 -2.54,0; 2 0,0; 3 2.54,0
1X01 = drill 1.016 pad 1.93 octagon: 1 0,0
IND_YUDEN_NS10165_YDN = smd 2.502 x 3.2: 1 -4.045,0; 2 4.045,0
R0402 = smd 0.5 x 0.6: P$1 -0.55,0; P$2 0.55,0
R0603 = smd 0.6 x 0.9: P$1 -0.75,0; P$2 0.75,0
21-0140L_T2055-4_MXM = smd 0.965 x 0.305: 1 -2.375,1.3; 2 -2.375,0.65; 3 -2.375,0; 4 -2.375,-0.65; 5 -2.375,-1.3; 11 2.375,-1.3; 12 2.375,-0.65; 13 2.375,0; 14 2.375,0.65; 15 2.375,1.3 | smd 0.305 x 0.965: 6 -1.3,-2.375; 7 -0.65,-2.375; 8 0,-2.375; 9 0.65,-2.375; 10 1.3,-2.375; 16 1.3,2.375; 17 0.65,2.375; 18 0,2.375; 19 -0.65,2.375; 20 -1.3,2.375 | smd 3.2 x 3.2: 21 0,0 | drill 0.35: 22 -1,1; 23 1,1; 24 1,-1; 25 -1,-1; 26 0,1; 27 -1,0; 28 0,0; 29 1,0; 30 0,-1
SOT26 = smd 0.55 x 0.8: 1 -0.95,-1.2; 2 0,-1.2; 3 0.95,-1.2; 4 0.95,1.2; 5 0,1.2; 6 -0.95,1.2
SOT23 = smd 0.8 x 0.9: 1 -0.95,-1; 2 0.95,-1; 3 0,1
QFN50P700X700X60-49N = smd 0.85 x 0.3: 1 -3.45,2.75; 2 -3.45,2.25; 3 -3.45,1.75; 4 -3.45,1.25; 5 -3.45,0.75; 6 -3.45,0.25; 7 -3.45,-0.25; 8 -3.45,-0.75; 9 -3.45,-1.25; 10 -3.45,-1.75; 11 -3.45,-2.25; 12 -3.45,-2.75; 25 3.45,-2.75; 26 3.45,-2.25; 27 3.45,-1.75; 28 3.45,-1.25; 29 3.45,-0.75; 30 3.45,-0.25; 31 3.45,0.25; 32 3.45,0.75; 33 3.45,1.25; 34 3.45,1.75; 35 3.45,2.25; 36 3.45,2.75 | smd 0.3 x 0.85: 13 -2.75,-3.45; 14 -2.25,-3.45; 15 -1.75,-3.45; 16 -1.25,-3.45; 17 -0.75,-3.45; 18 -0.25,-3.45; 19 0.25,-3.45; 20 0.75,-3.45; 21 1.25,-3.45; 22 1.75,-3.45; 23 2.25,-3.45; 24 2.75,-3.45; 37 2.75,3.45; 38 2.25,3.45; 39 1.75,3.45; 40 1.25,3.45; 41 0.75,3.45; 42 0.25,3.45; 43 -0.25,3.45; 44 -0.75,3.45; 45 -1.25,3.45; 46 -1.75,3.45; 47 -2.25,3.45; 48 -2.75,3.45 | smd 5.7 x 5.7: 49 0,0
SOIC8 = smd 1.549 x 0.61: 1 -2.7,1.905; 2 -2.7,0.635; 3 -2.7,-0.635; 4 -2.7,-1.905; 5 2.7,-1.905; 6 2.7,-0.635; 7 2.7,0.635; 8 2.7,1.905
LGA16 = smd 0.35 x 0.575: 1 -1.5,1.16; 2 -1,1.16; 3 -0.5,1.16; 4 0,1.16; 5 0.5,1.16; 6 1,1.16; 7 1.5,1.16; 9 1.5,-1.16; 10 1,-1.16; 11 0.5,-1.16; 12 0,-1.16; 13 -0.5,-1.16; 14 -1,-1.16; 15 -1.5,-1.16 | smd 0.575 x 0.35: 8 1.915,0; 16 -1.915,0
UDFN8_2X3_ONS = smd 0.711 x 0.254: 1 -1.499,0.75; 2 -1.499,0.25; 3 -1.499,-0.25; 4 -1.499,-0.75; 5 1.499,-0.75; 6 1.499,-0.25; 7 1.499,0.25; 8 1.499,0.75 | smd 1.295 x 1.397: 9 0,0
PQFN50P300X250X97-14N = smd 0.59 x 0.35: 1 -1.165,0.75; 2 -1.165,0.25; 3 -1.165,-0.25; 4 -1.165,-0.75; 8 1.165,-0.75; 9 1.165,-0.25; 10 1.165,0.25; 11 1.165,0.75 | smd 0.35 x 0.59: 5 -0.5,-0.915; 6 0,-0.915; 7 0.5,-0.915; 12 0.5,0.915; 13 0,0.915; 14 -0.5,0.915

### Placement (x,y rotation side)
3V3_TP  47.4,1.5 0 top
+5V  7.9,3.1 0 top
C1  31.9,8.2 0 top
C2  31.5,3.8 0 top
C3  31.5,6.1 0 top
C4  28.8,9.8 0 top
C5  25.9,1.2 180 top
C6  24.9,9.6 0 top
C7  13.2,13.6 90 top
C8  16.7,13.6 90 top
C9  17.68,56.5 90 top
C10  22.1,63.2 180 top
C11  28.3,53.5 270 top
C12  27,53.5 270 top
C13  25.7,53.5 270 top
C14  40.6,62.5 0 top
C15  30,61.7 90 top
C16  42.6,60.3 180 top
C17  38.1,60.3 0 top
C18  16.9,25.35 270 top
C19  22.1,34.5 180 top
C20  28.5,24.2 270 top
C21  27.2,24.2 270 top
C22  26,24.2 270 top
C23  37.9,19.9 0 top
C24  30.1,32.9 90 top
C25  43.12,24.1 0 top
C26  46.5,23.6 270 top
C27  33,29.2 180 top
C28  38.4,29.9 270 top
C29  8.4,26.3 270 top
C30  8.4,30.4 90 top
C31  7.8,39.3 180 top
C32  17.5,42.2 0 top
C33  22.1,50.4 180 top
C34  28.3,40.6 270 top
C35  27,40.6 270 top
C36  25.7,40.6 270 top
C37  31.4,36.1 180 top
C38  30.1,48.7 90 top
C39  42.5,45.6 180 top
C40  38.1,45.6 0 top
C41  32,23.6 180 top
C42  38.1,23.6 0 top
C43  31.2,55.4 270 top
C44  44.7,54.2 270 top
C45  44.5,39.3 270 top
C46  31.2,40.5 270 top
D1  8.9,0.9 0 top
D2  17.7,59.4 90 top
D3  19.5,59.4 90 top
D4  17.2,31.7 90 top
D5  18.8,31.7 90 top
D6  17.6,47.6 90 top
D7  19.4,47.6 90 top
D12  31.2,1.5 0 top
F1  32.6,9.8 180 top
GND  47.4,3.5 0 top
I2C  29.3,18.5 180 top
J1  43.2,5.4 90 top
J2  37.5,5.4 90 top
J4  3.5,32.5 90 bottom
JC1  53.3,52.5 270 top
JC2  41.1,52.5 270 top
JC3  53.3,37.5 270 top
JC4  41.1,37.5 270 top
JC5  53.3,26.3 270 top
JD1  11.9,58 90 top
JD2  11.9,44.5 90 top
JD3  11.9,27.9 90 top
JP6  15.3,18.5 0 top
JP7  8.3,47.2 0 top
JP8  8.3,49.74 0 top
L1  17.3,5.7 270 top
R1  48,7.4 270 top
R2  19.6,12 0 top
R3  20.5,13.9 90 top
R4  11.1,1.2 270 top
R5  10.5,11.6 90 top
R6  7.53,8.4 90 top
R7  17.7,62.2 270 top
R8  19.5,62.2 270 top
R9  46.6,53.9 225 top
R10  34.4,53.9 225 top
R11  16.6,33.9 0 top
R12  19.6,33.9 180 top
R13  47.3,27.3 270 top
R14  10.3,50.9 270 top
R15  7.6,40.8 90 top
R16  8.9,40.8 90 top
R17  17.6,50.4 270 top
R18  19.4,50.4 270 top
R19  46.6,39.2 225 top
R20  34.4,39.2 225 top
R21  46.7,7.4 90 top
R22  40.7,15 90 top
R23  42,15 90 top
R24  44.2,15 270 top
R25  45.5,15 90 top
R26  7.4,54.8 0 top
R27  7.4,56.3 0 top
R28  7.4,53.2 180 top
R29  7.3,33.7 180 top
R30  7.3,35.2 180 top
R31  7.3,36.7 180 top
REGOUT  14.5,5.4 0 top
SPI0_CS0  9.1,38.2 0 top
SPI0_MISO  9.1,35.2 0 top
SPI0_MOSI  9.1,33.7 0 top
SPI0_SCLK  9.1,36.7 0 top
SPI1_CS0  8.7,22.5 0 top
SPI1_CS1  10.2,22.5 0 top
SPI1_MISO  9.1,53.2 0 top
SPI1_MOSI  9.1,54.8 0 top
SPI1_SCLK  9.1,56.3 0 top
U1  25.8,5.4 180 top
U2  9.96,8.34 0 top
U3  9.7,4.6 90 top
U4  25.4,58.6 0 top
U5  34.2,59.1 270 top
U6  46.5,59.1 270 top
U7  25.4,29.9 0 top
U8  36,29.7 270 top
U9  42.9,27.3 0 top
U10  8.3,43.8 270 top
U11  25.4,45.8 0 top
U12  46.4,44.3 270 top
U13  34.2,44.3 270 top
U14  35,24.8 0 top
UT  8.1,61 90 top
V+  47.4,5.5 0 top

### Tracks (layer width: path | path; a pad name or v marks a point on that pad's centre or on a via)
5VSW
  pour Top (isolate 0.6, no thermals): 16.7,4.4 21,4.4 21,3.7 22.6,2.1 24.4,2.1 24.4,1.4 23.3,0.3 16.5,0.3 14.8,2 14.8,2.5
  pour Top (no thermals): 22.8,2 25.1,2 25.1,3.4 26.5,3.4 26.5,2.6 26,2.1 26,0.3 22.8,0.3
+3V3  (via drill 0.25, 0.35)
  Top 0.127: v16.05,34.65 R11.P$1 | v9.57,51.4 9.68,51.3 10.15,51.3 R14.P$1 | R16.P$1 8.88,40.27 7.62,40.27 R15.P$1 | 9.12,42.3 U10.8
  Top 0.254: C10.P$1 U4.48 | U4.20 26.15,54.5 C13.P$1 | U4.21 26.65,54.4 C12.P$1 | U4.23 27.65,54.7 C11.P$1 | v21,61.4 21.9,61.4 U4.1 | JD1.6 11.35,61.75 v11.3,61.7 | R8.P$1 18.65,62.75 v18.6,62.8 17.75,62.8 R7.P$1 | U4.35 29.4,60.85 29.73,60.88 C15.P$1 | C33.P$1 U11.48 | U11.4 20.65,47.05 v20.4,47.3 | U11.1 21.15,48.55 v21.1,48.6 | U11.20 26.15,41.6 C36.P$1 | U11.21 26.65,41.5 C35.P$1 | U11.23 27.65,41.8 C34.P$1 | R18.P$1 18.55,50.95 v18.5,51 17.65,51 R17.P$1 | JD2.6 11.72,48.25 v11.38,47.9 | C38.P$1 30,48.05 U11.35 | C19.P$1 U7.48 | v21.3,33.3 U7.1 | U7.3 21.45,31.65 21,32.1 v21,32.2 | v14.95,32.42 14.68,32.42 JD3.6 | C24.P$1 29.9,32.15 U7.35 | U7.20 26.15,24.9 C22.P$1 | U7.21 26.65,25.95 26.5,25.8 26.5,24.8 26.65,24.75 C21.P$1 | U7.23 27.65,25.85 28.2,25.5 28.2,25.35 28.5,25.05 C20.P$1 | U8.3 38.15,30.2 C28.P$1 | C27.P$1 U8.11 | R12.P$1 20.1,33.95 v20.1,34.7
  Top 0.305: C31.P$1 9.2,39.3 9.25,39.5 9.3,39.55 v9.35,39.55 9.35,39.8 R16.P$1 9.48,40.83 9.48,41.82 9.12,42.17 9.12,42.3 | C42.P$1 37.15,23.2 v36.7,23.2 36.6,23.2 36.16,23.64 U14.8 | U14.5 34.5,23.7 34.19,23.4 33.7,23.4 v33.5,23.2 33.1,23.6 C41.P$1
  Top 0.406: v22.7,64.1 22.7,63.25 C10.P$1 | C15.P$1 30.55,61.7 v30.7,61.7 | C33.P$1 v24.3,50.4 | C38.P$1 v30.9,48.15 | C19.P$1 22.65,35.25 v22.7,35.3 | v30.9,33.1 30.15,32.35 C24.P$1 | v38.1,31.2 38.1,30.75 C28.P$1 | C27.P$1 33.55,29.35 v33,30
  Top 0.508: R22.P$1 40.75,14.4 v40.75,13.7 | R25.P$1 45.55,14.4 v45.55,13.7
  other vias: 38.2,63 38.2,62.2 29.1,54 26.35,53.92 29.1,41.1 26.35,40.98 31.98,35.6 31.98,36.45 37.4,20.4 37.4,19.5 28.9,25.5 26.6,25.27 7.7,28.7 8.4,28.7 9.1,28.7 5.75,9.5 6.55,9.5 6.55,8.7 6.55,7.9
  pour Route15 (no thermals): 0.5,7 0.5,61.5 3.5,64.5 53.1,64.5 56,61.6 56,3.5 53,0.5 45.1,0.5 38.6,7
  pour Top (no thermals): 37.9,63.5 39.8,63.5 39.8,61.5 37.9,61.5
  pour Top (no thermals): 25.4,54.4 29.4,54.4 29.4,53.6 25.4,53.6
  pour Top (no thermals): 25.4,41.5 29.4,41.5 29.4,40.6 25.4,40.6
  pour Top (no thermals): 33.5,35.2 31.6,35.2 31.6,37 33.5,37
  pour Top (no thermals): 35.9,20.9 37.7,20.9 37.7,18.9 35.9,18.9
  pour Top (no thermals): 25.7,25 29.2,25 29.2,24.4 25.7,24.4
  pour Top (no thermals): 6.2,30.1 9.6,30.1 9.6,27.7 6.2,27.7
  pour Top (no thermals): 4.1,9.8 6.8,9.8 6.8,7.8 4.1,7.8
  pour Top (no thermals): 28.5,25.8 29.2,25.8 29.2,25 28.5,25
+5V  (via drill 0.45, 0.5)
  Top 0.406: R4.P$1 10.35,1.75 8.7,3.4 U3.3 7.75,5.55 6.2,7.1
  Top 0.508: JP6.1 12.76,17.4 9.01,13.64 U2.6 8.8,9.33 v8.8,8.6 | v7.9,6.7 6.6,6.7 6.2,7.1 | v41.9,12.8 42,12.9 R23.P$1
  Top 0.61: +5V.P$1 6.9,3.9 6.8,4.9 7.25,5.55 7.75,5.55
  Bottom 0.508: v8.8,8.6 7.9,7.7 v7.9,6.7 | JP6.1 12.76,17.2 13.46,16.5 20.8,16.5 25,12.3 41.4,12.3 v41.9,12.8
  pour Top (no thermals): 0.3,11.9 3.4,11.9 3.4,7.4 6.1,7.4 8.2,5.4 9.1,5.4 9.1,3.7 7.3,3.7 4.3,5.2 0.3,5.2
AUX_IRQ1  (via drill 0.3)
  Top 0.254: U7.17 24.6,26.4 24.6,24 v23.6,23
  Bottom 0.254: v23.6,23 16.5,23 13.1,26.4 5.02,26.4 J4.15
AUX_IRQ2  (via drill 0.3)
  Top 0.254: U7.18 25.15,25.65 25,25.5 25,23.6 v23.6,22.2
  Bottom 0.254: v23.6,22.2 23.5,22.3 15.9,22.3 13.1,25.1 3.28,25.1 J4.16
AUX_IRQ3  (via drill 0.3)
  Top 0.254: U7.19 25.59,26.39 25.59,25.55 25.38,25.34 25.38,23.44 24.6,22.66 24.6,22 v24.1,21.5
  Bottom 0.254: v24.1,21.5 15.3,21.5 12.08,24.72 1.88,24.72 1.2,25.4 1.2,27.66 J4.18
CAN_VCC  (via drill 0.35)
  Top 0.305: v41.8,26.7 41.8,26.66 U9.3 40.4,26.46 41.96,26.46
  Top 0.508: 41.96,26.46 42.58,25.85 C25.P$1 42.58,16.12 R23.P$2 R22.P$2 | v41.8,26.7 43.3,28.2 43.3,32.7 42.85,33.15 42.85,45.4 C39.P$1 | C39.P$1 45.4,45.6 45.61,45.81 | 45.61,45.81 46.23,45 48.1,45 49.4,46.3 49.4,48.1 48.8,48.7 46.8,48.7 42.85,52.65 42.85,59.7 43.15,60 C16.P$1 | 45.61,45.81 45.77,45.97 U12.3 | C39.P$1 43.05,45.15 42.4,44.5 38.1,44.5 37.55,45.05 C40.P$1 36.95,45 34.4,45 33.56,45.84 U13.3 | C16.P$1 43.25,60.2 44.8,60.2 45.87,61.27 U6.3 | C16.P$1 43.15,60.05 42.3,59.2 38.65,59.2 C17.P$1 36.95,59.7 34.4,59.7 33.56,60.53 U5.3
CAN_VIO  (via drill 0.5)
  Top 0.508: 45.5,25.15 R25.P$2 R24.P$1 | U12.5 43.6,40.7 43.6,33.7 44.2,33.1 44.2,26.1 44.91,25.39 U9.5 45.5,25.3 45.5,25.15 | U12.5 44.49,43.3 | 44.49,43.3 45.4,44.2 49.5,44.2 50.1,44.8 50.1,48.67 49.37,49.4 47.2,49.4 43.9,52.7 43.9,55.7 U6.5 | C44.P$1 44.59,54.85 U6.5 | C45.P$1 U12.5 | 44.49,43.3 44.19,43.6 v43.8,43.6 | v41.9,43.5 32.9,43.5 32.3,42.9 U13.5 31.75,41.6 C46.P$1 | U6.5 44.59,57.7 v44.1,58.2 | v42,58.3 33,58.3 32.3,57.59 U5.5 31.65,56.4 C43.P$1 | C26.P$1 45.5,25.15
  Bottom 0.508: v43.8,43.6 43.7,43.5 v41.9,43.5 | v44.1,58.2 42.1,58.2 v42,58.3
FB
  Top 0.254: R2.P$2 20.8,11.35 23.41,11.35 24.6,10.16 24.6,8.9 25.15,8.35 U1.9
  Top 0.406: R3.P$1 20.5,12.35 R2.P$2
GND  (via drill 0.25, 0.35, 0.6)
  Top 0.127: 8.38,24.88 C29.P$2
  Top 0.254: U4.4 21.35,59.85 v21.1,60.1 21.35,60.35 U4.3 | C9.P$2 18.32,57.05 v18.4,57.1 | v11.3,58.8 13.85,58.8 JD1.4 | v41.8,50.5 JC2.3 | JC1.3 v54,50.5 | U11.3 21.15,47.55 v20.8,47.9 | v18.8,42.2 C32.P$2 | JD2.4 11.57,45.25 v11.38,45.45 | U7.4 21.15,31.15 20.2,32.1 v20.2,32.2 | JD3.4 11.35,28.65 v11.3,28.7 | U8.4 38.05,29.7 C28.P$2 | JC4.3 v41.9,35.5 | JC3.3 53.78,35.5 v54,35.6 | JC5.3 v54,24.3 | v38.2,28.2 U8.7 U8.6 | U1.14 24.85,4.75 U1.23 24.5,4.1 | U1.15 24.5,4.1 | U1.16 24.5,4.1 | U10.4 U10.3 U10.2 | U10.2 U10.1 | U10.2 8.55,46.95 JP7.1
  Top 0.305: C6.P$2 26.05,9.3 | U1.13 22.3,5.4 | v49.1,7 48.95,6.85 R1.P$2 | C31.P$2 6.97,39.3 v6.45,39.83 | C18.P$2 16.82,24.73 v16.82,24.07 | v41.6,28 41.53,27.93 U9.2 | C28.P$2 38.4,28.4 v38.2,28.2 | v43.8,23 43.67,23.12 C25.P$2 | v38.6,24.38 38.65,24.32 C42.P$2 | U14.6 v35,23.18 | v31.9,24.27 31.9,24.05 C41.P$2
  Top 0.406: D1.CATHODE v7.2,0.9 | R5.P$2 v10.5,13.2 | v7.7,10.2 7.53,10.03 R6.P$2 | C4.P$2 v28.82,9.8 | v20.5,15.2 R3.P$2 | C10.P$2 21.55,64.05 v21.5,64.1 | C15.P$2 30,62.72 29.96,62.69 30,62.73 v30,63 | v20.8,50.4 C33.P$2 | C38.P$2 30.25,49.4 v30.85,49.4 | C19.P$2 21.55,35.25 v21.5,35.3 | v30.1,34.2 C24.P$2 | C27.P$2 32.45,29.15 v31.75,29.2
  Top 0.508: v8.38,25.75 8.38,24.88 | U9.8 45.52,29.28 v45.52,29.93 | R24.P$2 v44.2,13.7 | C44.P$2 44.7,53.1 v44.9,52.9 | C45.P$2 v44.5,38 | C40.P$2 v39.4,45.6 | C39.P$2 v41.2,45.6 | U13.2 34.9,46.94 v34.9,45.8 | v37,42 36.6,41.6 U13.8 | U12.2 47.03,45.84 v47,45.8 | U12.8 49.01,42.3 v49.2,42.3 | U6.8 49.1,57.1 v49.3,57.1 | U6.2 47.13,60.53 v47.1,60.5 | C17.P$2 v39.4,60.3 | v41.3,60.3 C16.P$2 | U5.2 34.84,60.63 v34.8,60.6 | U5.8 36.7,57 v37,57 | C43.P$2 v31.2,54.1 | C46.P$2 v31.2,39.17 | C26.P$2 v46.5,22
  Top 0.61: 22.3,5.4 22,5.4 21.2,6.2
  Top 1.016: 21.2,6.2 v21.2,9.7
  other vias: 25.4,58.6 25.4,45.8 25.4,29.9 31.9,5.88 31.9,3.6 32.2,1.4 12.5,14 13.9,14 16,14 17.4,14 41.1,62.8 41.1,62 28.3,52.2 27,52.2 25.7,52.2 28.3,39.38 27,39.38 25.7,39.38 30.9,35.7 30.9,36.6 28.5,22.98 27.2,22.98 26.1,22.98 38.4,20.4 38.4,19.5 8,31.9 8.9,31.9 25.4,31.5 25.4,28.2 25.4,47.5 25.4,44.1 25.4,60.3 25.4,56.9 25.4,9.3 22.4,4.4 22,9.7 22,10.4 21.2,10.4 22.5,3.6 23.4,3.5 25.4,10 31.9,2.5 31.9,4.72
  pour Route2 (rank 2, no thermals): 0.5,3.5 0.5,61.5 3.5,64.5 53,64.5 56,61.6 56,3.5 53,0.5 3.5,0.5
  pour Top (isolate 0.7, no thermals): 32.4,8.7 33.3,8.7 37.25,4.75 45.05,4.75 45.05,0.35 31.4,0.35 31.4,6.1 32.4,7.1
  pour Top (no thermals): 12,15.5 18.1,15.5 18.1,13.5 12,13.5
  pour Top (no thermals): 40.7,63.3 42.5,63.3 42.5,61.6 40.7,61.6
  pour Top (no thermals): 25.4,53.2 28.8,53.2 28.8,51.8 25.4,51.8
  pour Top (no thermals): 25.2,40.3 28.9,40.3 28.9,38.9 25.2,38.9
  pour Top (no thermals): 31.3,35.3 29.5,35.3 29.5,37.1 31.3,37.1
  pour Top (no thermals): 38,20.9 39.9,20.9 39.9,18.9 38,18.9
  pour Top (no thermals): 25.7,23.9 29.1,23.9 29.1,22.6 25.7,22.6
  pour Top (no thermals): 7.6,32.1 9.3,32.1 9.3,30.6 7.6,30.6
  pour Top (no thermals): 22,4.9 24,4.9 24,3.1 22.7,3.1 22,3.8
  pour Top (no thermals): 20.8,10.7 22.3,10.7 22.3,9.4 20.8,9.4
  pour Top (no thermals): 25.2,10.4 26.6,10.4 26.6,8.9 25.2,8.9
GNDSEP
  pour Route2: 56.1,11.5 56.1,11.3 32,11.3 29.4,8.7 19.8,8.7 19.8,11.1 18.4,12.5 18.3,12.5 18.4,12.6 18.4,15.8 18.7,15.8 18.7,12.6 20,11.3 20,9 29.3,9 31.8,11.5
I2C1_SCL  (via drill 0.3)
  Top 0.254: J4.5 7.9,16.58 7.9,19.1 9.7,20.9 20.9,20.9 v21.2,20.6
  Bottom 0.254: v21.2,20.6 27,20.6 28.03,19.57 I2C.3
I2C1_SDA  (via drill 0.3)
  Top 0.254: J4.3 6.8,12.94 6.8,14.3 8.6,16.1 8.6,18.6 10.5,20.5 19.6,20.5 v21.2,18.9
  Bottom 0.254: v21.2,18.9 24.2,15.9 29.9,15.9 30.57,16.57 I2C.2
ID_SCL
  Top 0.127: R16.P$2 8.6,41.35 8.12,41.83 8.12,42.3 U10.6
  Top 0.254: J4.28 2.51,41.39 3.7,40.2 5.9,40.2 6.5,40.8 8.35,40.8 R16.P$2
ID_SDA
  Top 0.127: R15.P$2 7.62,41.4 7.62,42.3 U10.5
  Top 0.254: J4.27 7.56,41.39 R15.P$2
IFACEA_IRQ1
  Top 0.254: U4.17 24.65,53.15 24.07,52.58 19.12,52.58 18.5,53.2 10.8,53.2 9.6,52 7.3,52 5.7,50.4 4.1,50.4 3.6,50.9 3.6,52.92 J4.37
IFACEB_IRQ1  (via drill 0.3)
  Top 0.254: U11.17 24.65,40.85 24.1,40.3 v20.1,40.3
  Bottom 0.254: v20.1,40.3 8.4,40.3 J4.29
IMU2_CLKIN  (via drill 0.35)
  Top 0.152: U7.22 27.15,25.6 v27.24,25.51 | v30.08,25.1 30.08,22.72 30.11,22.7 37.7,22.7 38.1,23.1 38.1,24 37.58,24.52 36.19,24.52 U14.9
  Bottom 0.152: v27.24,25.51 27.9,24.85 29.83,24.85 v30.08,25.1
IMU2_CS
  Top 0.152: U7.24 29.25,26.45 29.6,26.1 29.6,22.4 39.2,22.4 39.2,23.2 39.3,23.3 39.3,24.7 39.1,24.9 37.5,24.9 36.8,25.6 36.8,26.1 35.88,26.1 U14.12
IMU_ACC_INT  (via drill 0.3)
  Top 0.127: v35.25,32.15 35.5,32.15 36,31.65 U8.16 | v31.25,31.15 30.75,30.65 U7.32
  Bottom 0.127: v35.25,32.15 32.25,32.15 v31.25,31.15
IMU_CS1
  Top 0.127: U7.31 31,30.15 32,31.15 33.25,31.15 33.75,30.65 34.75,30.65 U8.14
IMU_CS2
  Top 0.127: U8.5 37,29.15 36.75,29.15 36.5,28.9 36.5,27.05 29.1,27.05 29,27.15 U7.25
IMU_GYRO_INT  (via drill 0.35)
  Top 0.127: U7.30 v31.1,29.65 31.25,29.65 32.25,30.65 33.25,30.65 34.25,29.65 34.75,29.65 U8.12
  Top 0.152: v31.67,25.3 31.87,25.3 32.37,24.8 33,24.8 33.1,24.7 33.1,24.2 33.25,24.05 U14.4
  Bottom 0.152: v31.1,29.65 31.1,29.05 31.6,28.55 31.6,25.37 v31.67,25.3
IMU_MISO  (via drill 0.35)
  Top 0.127: 35.25,28.65 35,28.65 U8.10 | 35.25,28.65 35.5,28.9 35.5,30.4 35.5,31.15 35,31.15 U8.15 | U7.27 30,28.15 30.5,27.65 35.25,27.65 35.5,27.9 35.5,28.65 35.25,28.65
  Top 0.152: 35.5,30.4 v36,30.4 | v32.4,25.7 32.55,25.55 U14.1
  Bottom 0.152: v36,30.4 34.8,29.2 32.4,29.2 v32.4,25.7
IMU_MOSI  (via drill 0.35)
  Top 0.127: U7.28 30,28.65 30.5,28.15 33.9,28.15 34.75,28.15 U8.9
  Top 0.152: 33.9,28.15 33.6,28.45 v33.6,28.5 | v33.7,26.4 33.8,26.4 34.48,25.71 U14.14
  Bottom 0.152: v33.6,28.5 33.7,28.4 v33.7,26.4
IMU_SCK  (via drill 0.35)
  Top 0.127: U7.26 29.25,27.65 29.55,27.35 35.7,27.35 36,27.65 U8.8
  Top 0.152: U8.8 35.97,27.82 v35.97,29 | v35,26.5 U14.13
  Bottom 0.152: v35.97,29 35.97,27.47 v35,26.5
N$1
  Top 0.127: R5.P$1 9.65,10.85 9.47,10.68 9.47,7.6 U2.2
  Top 0.406: U2.2 U2.3 | R5.P$1 10.9,10.45 U2.4
N$2
  Top 0.254: JC1.1 50.55,54.29 R9.P$1 46.99,56.25 U6.7
N$3
  Top 0.254: J4.38 3.34,55.2 6.45,55.2 R26.P$1
N$4
  Top 0.254: JC1.2 47.22,52.5 R9.P$2 45.87,53.86 U6.6
N$5
  Top 0.406: U3.1 9.7,3.65 9.7,6.3 9.4,6.3 9.1,6.6 9.1,7.05 U2.1 8.5,7.65 R6.P$1
N$6
  Top 0.254: J4.40 3.26,55.6 6.15,55.6 R27.P$1
N$7
  Top 0.254: U5.7 34.79,56.35 R10.P$1 38.35,54.29 JC2.1
N$8
  Top 0.254: U5.6 33.56,53.96 R10.P$2 35.02,52.5 JC2.2
N$9
  Top 0.406: D1.ANODE 10.85,0.9 R4.P$2
N$10
  Top 0.254: J4.35 6.42,53.2 R28.P$2
N$11
  Top 0.254: U4.33 31.05,59.85 32.3,61.09 U5.4
N$12
  Top 0.254: R29.P$2 6.75,33.21 J4.19
N$13  (via drill 0.3)
  Top 0.254: JD1.2 14.1,55.95 C9.P$1 18.25,55.95 v18.4,55.8 | v20.9,57.6 20.9,58 21.25,58.35 U4.7
  Bottom 0.254: v18.4,55.8 19.1,55.8 v20.9,57.6
N$14
  Top 0.305: U1.20 27.1,1.45 C5.P$1
N$15  (via drill 0.3)
  Top 0.254: JD1.3 16.45,57.25 v16.5,57.3 | v29,62.1 28.85,61.95 U4.36
  Bottom 0.254: v16.5,57.3 18.6,59.4 26.3,59.4 v29,62.1
N$16  (via drill 0.3)
  Top 0.254: JD1.5 16.05,60.25 16.8,61 v16.8,62.1 | v28.1,63.2 28.15,63.15 U4.37
  Bottom 0.254: v16.8,62.1 27,62.1 v28.1,63.2
N$17
  Top 0.254: U4.41 26.2,62.1 26.2,63 27.1,63.9 43.6,63.9 44.59,62.91 U6.4
N$18
  Top 0.254: U4.42 25.7,62.1 25.7,63.1 26.9,64.3 47.4,64.3 48.41,63.3 U6.1
N$19
  Top 0.254: U1.7 26.45,8.35 26.61,8.51 27.51,8.51 28.05,9.05 C4.P$1
N$20
  Top 0.254: J4.21 6.2,35.2 R30.P$2
N$21
  Top 0.305: 22.4,6.3 22.65,6.05 U1.12
  Top 0.61: C6.P$1 22.4,8.55 22.4,6.3
N$22
  Top 0.254: J4.23 5.16,36.7 R31.P$2
N$23
  Top 0.254: JC3.1 47.08,39.5 R19.P$1 46.99,41.55 U12.7
N$25
  Top 0.254: JC3.2 47.52,37.5 R19.P$2 45.77,39.26 U12.6
N$26
  Top 0.254: JC4.1 34.88,39.5 R20.P$1 34.79,41.55 U13.7
N$27
  Top 0.254: JC4.2 38.56,37.55 35.27,37.55 R20.P$2 33.56,39.26 U13.6
N$28
  Top 0.254: R8.P$2 D3.ANODE
N$29
  Top 0.127: 21.88,59.38 U4.5
  Top 0.254: D3.CATHODE 20.23,59.38 21.88,59.38
N$30
  Top 0.254: R7.P$2 D2.ANODE
N$31
  Top 0.127: 21.88,58.88 U4.6
  Top 0.254: D2.CATHODE 18.45,57.9 20,57.9 20.98,58.88 21.88,58.88
N$32
  Top 0.254: JD2.2 16.9,42.25 C32.P$1 20.3,45.55 U11.7
N$33  (via drill 0.3)
  Top 0.254: JD2.3 15.95,43.75 16.7,44.5 16.7,51.5 17,51.8 18.5,51.8 18.85,51.45 19.8,51.45 19.86,51.4 v24.4,51.4 | v29.1,49.2 29.1,48.8 U11.36
  Bottom 0.254: v24.4,51.4 26.6,49.2 v29.1,49.2
N$34  (via drill 0.3)
  Top 0.254: JD2.5 15.75,46.75 16.3,47.3 16.3,51.9 16.7,52.3 18.6,52.3 18.8,52.1 24.6,52.1 v25.6,51.1 | v28.2,50.19 28.2,49.3 U11.37
  Bottom 0.254: v25.6,51.1 26.51,50.19 v28.2,50.19
N$35
  Top 0.254: R18.P$2 D7.ANODE
N$36
  Top 0.254: U11.5 19.7,46.55 D7.CATHODE
N$37
  Top 0.254: R17.P$2 D6.ANODE
N$38
  Top 0.254: D6.CATHODE 18.4,46.05 U11.6
N$39
  Top 0.254: U11.33 32.24,47.05 U13.4
N$40
  Top 0.254: U11.34 31.15,47.55 32.1,48.5 35.4,48.5 36.1,47.8 U13.1
N$41
  Top 0.254: U11.41 26.2,49.3 26.2,50 26.9,50.7 34,50.7 35.4,49.3 43.3,49.3 44.49,48.1 U12.4
N$42
  Top 0.254: U11.42 25.7,49.3 25.7,50.1 26.7,51.1 34.1,51.1 34.6,51.6 42.7,51.6 46.2,48.1 47.8,48.1 48.3,47.59 U12.1
N$44  (via drill 0.25)
  Top 0.127: R14.P$2 9.85,50.35 9.25,49.75 8.38,49.75 JP8.1 | v9.5,42.92 8.62,42.92 8.62,42.42 U10.7
  Bottom 0.127: v9.5,42.92 9.5,48.5 8.38,49.62 JP8.1
N$45
  Top 0.305: U9.7 47.22,27.93 R13.P$1 49.77,27.85 JC5.1
N$46
  Top 0.305: U9.6 47.22,26.66 R13.P$2 50.52,26.75 JC5.2
N$47
  Top 0.254: C18.P$1 16.9,27 19.55,29.65 U7.7
  Top 0.305: JD3.2 14.15,25.9 C18.P$1
N$48  (via drill 0.3)
  Top 0.127: 28.8,32.65 U7.36
  Top 0.254: JD3.3 15.95,27.15 16.6,27.8 16.6,28.9 v17.3,29.6 | v28.9,33.4 28.9,32.75 28.8,32.65
  Bottom 0.254: v17.3,29.6 24.1,29.6 25.11,30.6 26.1,30.6 v28.9,33.4
N$49  (via drill 0.3)
  Top 0.254: JD3.5 15.55,30.15 v16.3,30.9 | v28.1,34.6 28.15,34.55 U7.37
  Bottom 0.254: v16.3,30.9 22.8,30.9 26.5,34.6 v28.1,34.6
N$50
  Top 0.254: R12.P$2 18.8,33.65 D5.ANODE
N$51
  Top 0.254: U7.5 19.1,30.65 D5.CATHODE
N$52
  Top 0.127: 17.23,32.57 D4.ANODE
  Top 0.254: R11.P$2 17.23,33.82 17.23,32.57
N$53
  Top 0.254: U7.6 18,30.15 D4.CATHODE
N$54
  Top 0.127: 39.9,25.39 U9.4
  Top 0.254: U7.33 30.45,31.15 32.1,32.8 37.5,32.8 39,31.3 39,26.3 39.9,25.39
N$55
  Top 0.254: U7.34 30.41,31.65 31.94,33.18 37.82,33.18 40.2,30.8 U9.1
N$100
  Top 0.254: U4.34 30.55,60.35 31.4,61.2 31.4,62.5 32.1,63.2 35.6,63.2 36.1,62.7 U5.1
PI32
  Top 0.254: J4.32 0.6,48.1 0.6,57.6 1.6,58.6 7.96,58.6 UT.1
PI33
  Top 0.254: J4.33 3.68,50.1 2.1,50.1 1.1,51.1 1.1,57.2 2.1,58.2 5.5,58.2 6.4,57.3 9.6,57.3 10.2,57.9 10.2,59.9 9.1,61 UT.2
REGOUT
  pour Top (no thermals): 10.3,6 11.77,7.47 11.77,8.37 13.67,8.37 13.67,4.9 10.3,4.9
  pour Top (no thermals): 9.7,9.9 10.3,9.9 10.3,8.9 11.4,8.9 11.8,9.3 11.8,12.6 19.4,12.6 19.4,8.6 16.8,6 15.7,6 15.7,5.2 14.8,4.3 12.5,4.3 11.5,5.3 11.5,7.8 9.8,7.8 9.7,7.9
SPI0_CS0  (via drill 0.3)
  Top 0.254: v20.8,27.1 21.9,27.1 U7.12 | J4.24 3.52,37.6 5.9,37.6 6.5,38.2 SPI0_CS0.P$1
  Bottom 0.254: SPI0_CS0.P$1 10.1,37.2 10.1,36.9 13.5,33.5 13.5,30.5 15.3,28.7 19,28.7 20.6,27.1 v20.8,27.1
SPI0_MISO  (via drill 0.3)
  Top 0.254: v22.7,24.9 22.7,25.1 23.1,25.5 23.1,26.4 U7.14 | R30.P$1 SPI0_MISO.P$1
  Bottom 0.254: SPI0_MISO.P$1 12.5,31.8 12.5,30.2 15,27.7 18.3,27.7 21.1,24.9 v22.7,24.9
SPI0_MOSI  (via drill 0.3)
  Top 0.254: v23.5,24.7 23.65,24.85 U7.15 | R29.P$1 SPI0_MOSI.P$1
  Bottom 0.254: SPI0_MOSI.P$1 9.5,33.7 12,31.2 12,30.1 15,27.1 18,27.1 20.9,24.2 23.1,24.2 23.55,24.65 v23.5,24.7
SPI0_SCLK  (via drill 0.3)
  Top 0.254: v22.1,25.5 22.65,26.05 U7.13 | R31.P$1 SPI0_SCLK.P$1
  Bottom 0.254: SPI0_SCLK.P$1 9.1,36.5 13,32.6 13,30.3 15.1,28.2 18.6,28.2 21.3,25.5 v22.1,25.5
SPI1_CS0  (via drill 0.3)
  Top 0.254: v14.9,52.3 14.3,52.3 14.1,52.1 14.1,49.6 13.5,49 11.1,49 10.8,48.7 10.8,39.57 10.79,39.55 10.79,36.49 10,35.7 10,23.8 SPI1_CS0.P$1 8.5,22.3 3.46,22.3 J4.12 | v20.7,55.8 21.9,55.8 U4.12
  Bottom 0.254: v14.9,52.3 15,52.4 17.3,52.4 v20.7,55.8
SPI1_CS1
  Top 0.254: U11.12 21.45,43.05 18.4,40 14.9,40 14.2,39.3 14.2,37.9 13.8,37.5 12.6,37.5 10.4,35.3 10.4,22.7 SPI1_CS1.P$1 9,21.3 5,21.3 J4.11
SPI1_MISO  (via drill 0.3)
  Top 0.254: U11.14 23.1,42.3 v23.1,41.1 | U4.14 23.15,53.55 23.2,53.5 v23.2,53.6 20.5,53.6 19.1,55 11.1,55 10.5,54.4 10.5,54.3 9.4,53.2 SPI1_MISO.P$1 R28.P$1
  Bottom 0.254: v23.2,53.6 23.2,41.2 v23.1,41.1
SPI1_MOSI  (via drill 0.3)
  Top 0.254: U11.15 23.65,41.45 v23.8,41.3 | U4.15 23.65,54.38 23.8,54.14 v23.8,53.1 23.77,53.08 19.73,53.08 19.2,53.6 10.62,53.6 9.43,52.4 7.74,52.4 7.4,52.74 7.4,54.25 R26.P$2 SPI1_MOSI.P$1
  Bottom 0.254: v23.8,41.3 23.7,41.4 23.7,53 v23.8,53.1
SPI1_SCLK  (via drill 0.3)
  Top 0.254: U11.13 22.65,41.65 v22.4,41.4 | R27.P$2 SPI1_SCLK.P$1 9.3,56.5 18.8,56.5 21.1,54.2 v22.5,54.2 22.5,55 U4.13
  Bottom 0.254: v22.4,41.4 22.7,41.7 22.7,52.88 22.69,52.89 22.69,54.01 v22.5,54.2
V+
  Top 0.305: V+.P$1 46.7,5.5 R21.P$1
  Top 0.61: J1.2 45.6,5.5 V+.P$1
  pour Top (no thermals): 33,10.35 45.05,10.35 45.05,5.65 37.45,5.65 33.8,9.3 33,9.3
V+FUSED
  pour Top (isolate 0.4, no thermals): 30.6,10.5 32.5,10.5 32.5,9.1 31.7,9.1 31.7,7.5 30.7,6.5 30.7,0.3 28.8,0.3 28.2,0.9 28.2,2.8 27.7,3.3 27.7,6.3 28.9,6.3 30.4,7.8 30.4,9.5 30.6,9.7
V+SENSE
  Top 0.254: R21.P$2 46.7,9.85 45.55,11 24.5,11 22.8,12.7 22.8,23.2 24.15,24.55 U7.16
  Top 0.305: R1.P$1 R21.P$2

### Text on the board
tPlace: pi3hat r4.5 | (c) 2022
tNames: CK | MO | SPI1 | MI | CS | CK | SPI0 | MI | MO | 0 | 1 | 5 | 3 | G | G | SCL | SDA | 3 | SPI1_CS | V+ | G | +5V | 3
bNames: REGOUT